# Altium project FMC_DAC_125M_14B_16CHA.PrjPCB (part 1 of 2)
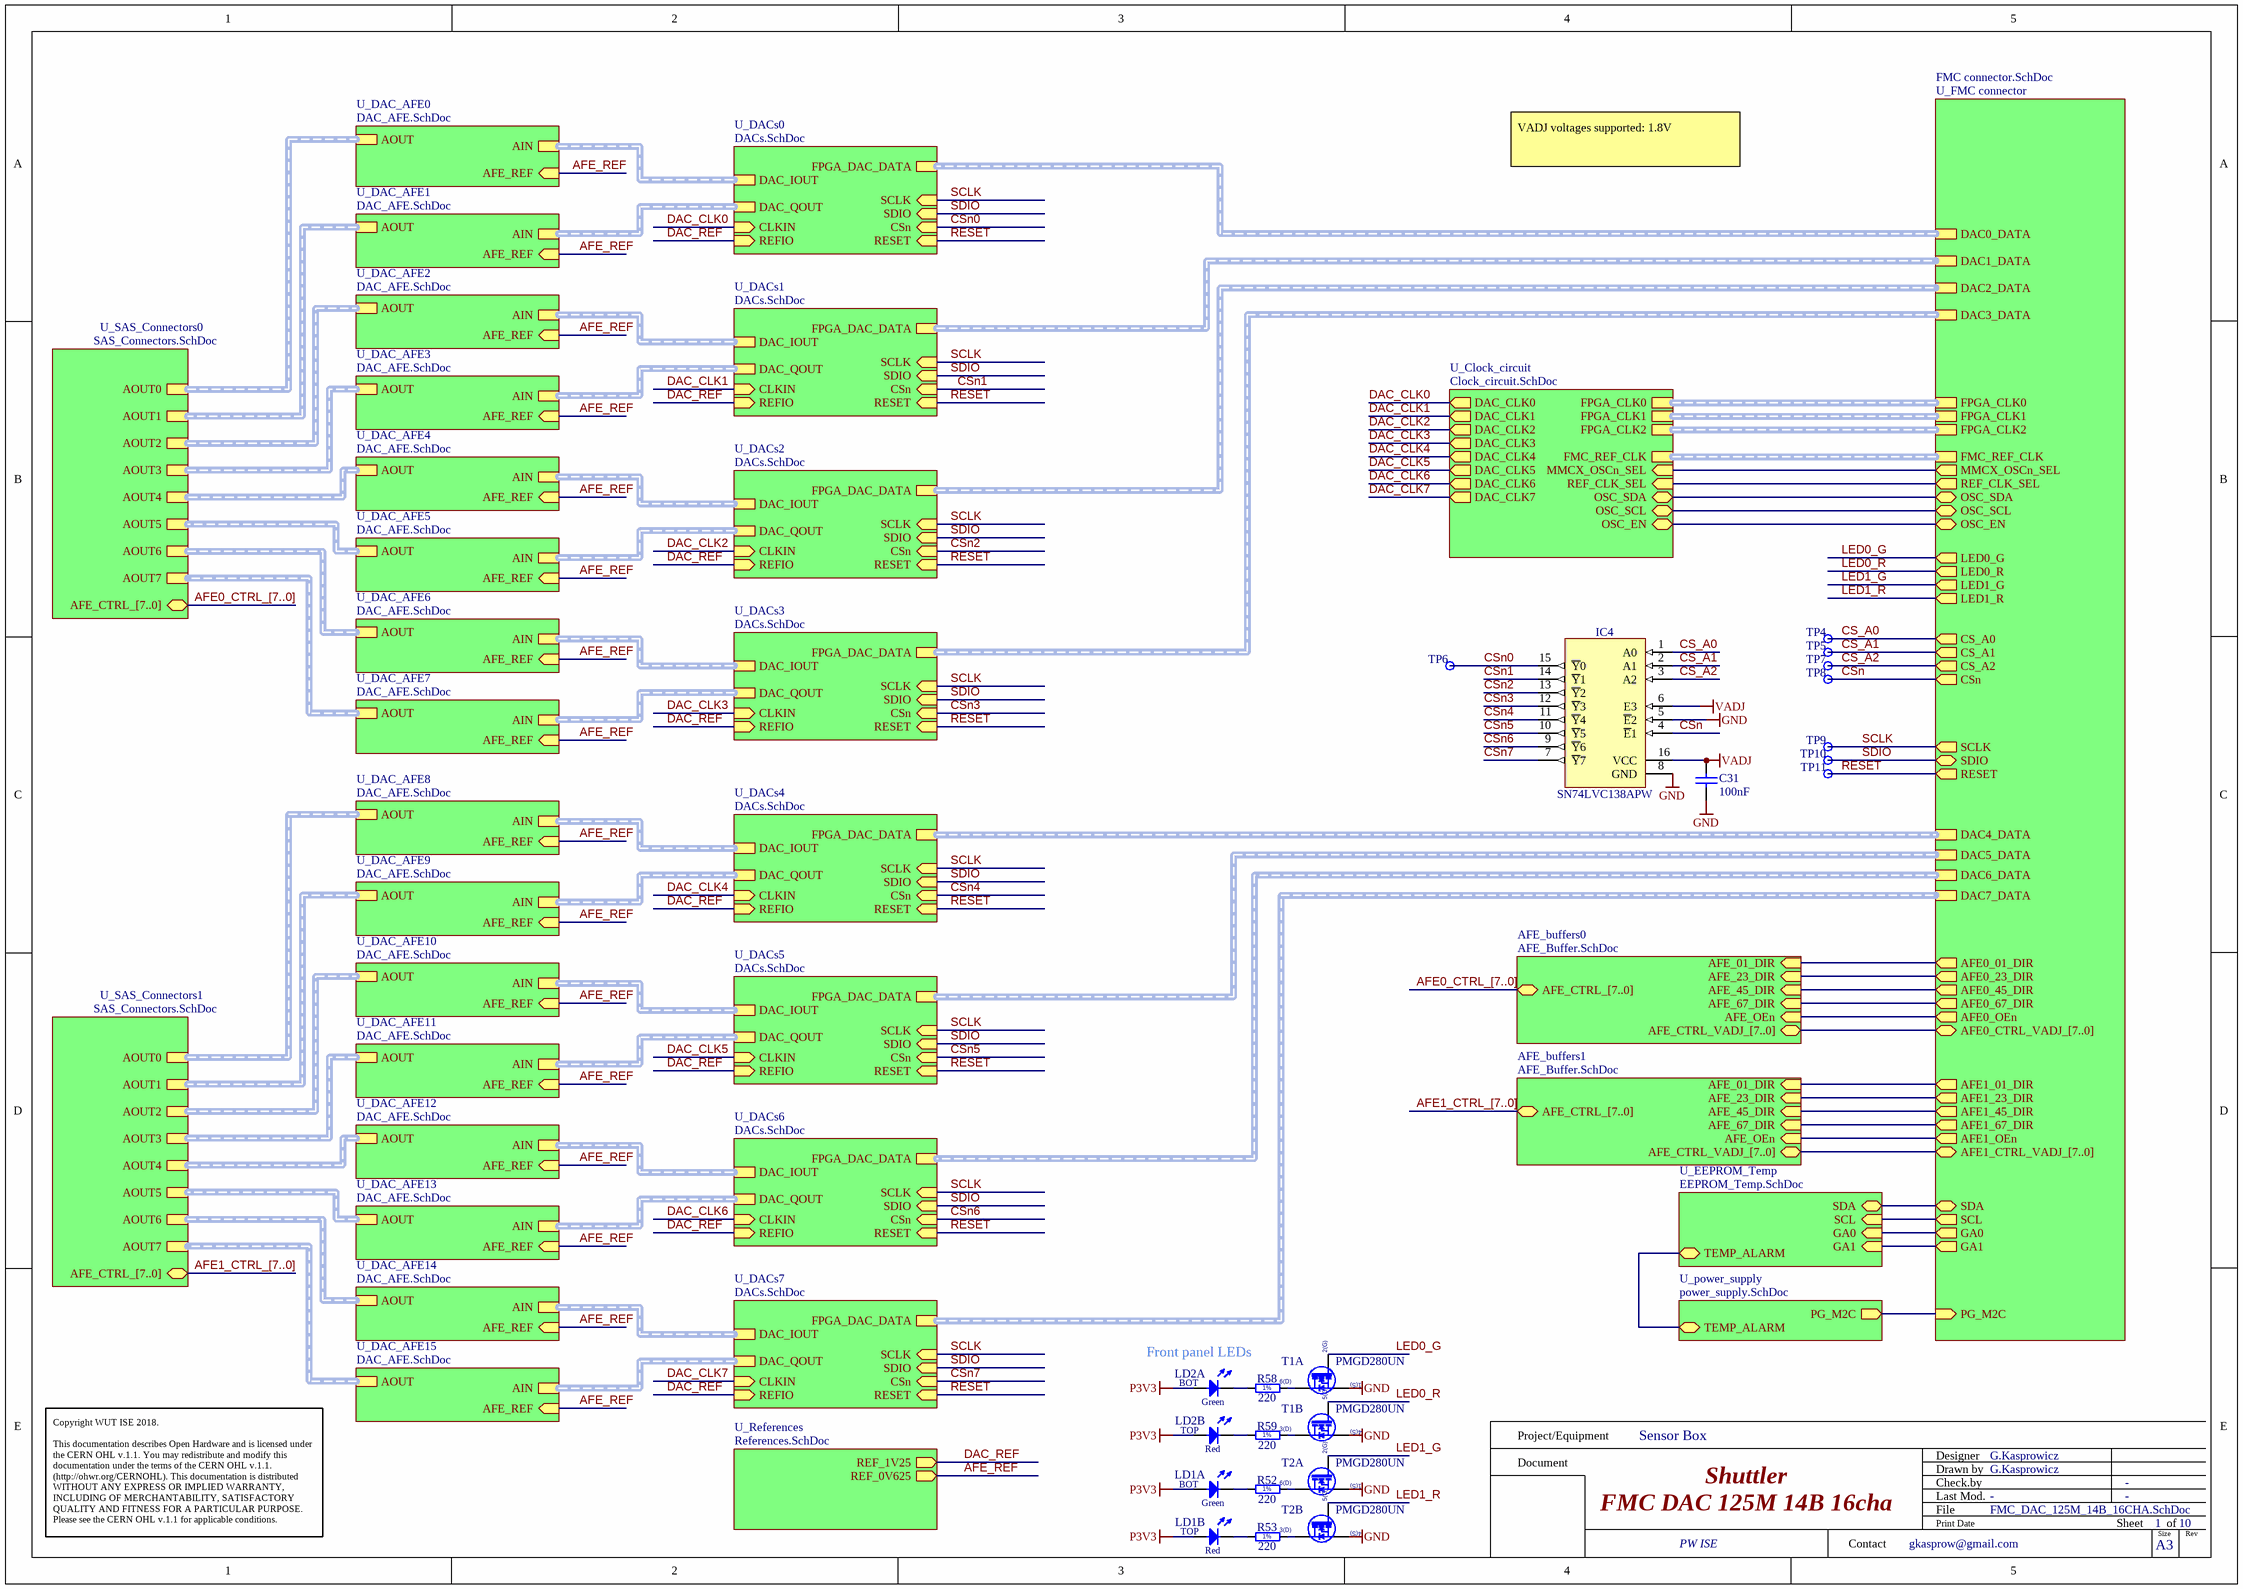
[diagram p0: FMC_DAC_125M_14B_16CHA.SchDoc]
P_version: 1.2
5 sheets, 161 parts. Net scope: hierarchical (ports join the sheet entries above them; power ports are global).
Board file: FMC_DAC_125M_14B_16CHA.PcbDoc
Sheets:
  FMC_DAC_125M_14B_16CHA.SchDoc
    U_EEPROM_Temp = EEPROM_Temp.SchDoc
    U_DACs0 = DACs.SchDoc
    U_DACs1 = DACs.SchDoc
    U_DACs2 = DACs.SchDoc
    U_DACs3 = DACs.SchDoc
    U_DACs4 = DACs.SchDoc
    U_DACs5 = DACs.SchDoc
    U_DACs6 = DACs.SchDoc
    U_DACs7 = DACs.SchDoc
    U_Clock_circuit = Clock_circuit.SchDoc
    U_References = References.SchDoc

## Sheet FMC_DAC_125M_14B_16CHA.SchDoc: Shuttler
size 420 x 297 mm; Author: G.Kasprowicz; CompanyName: WUT ISE; DrawnBy: G.Kasprowicz; Organization: WUT ISE; Address1: PW ISE; Address2: Nowowiejska 15/19 00-665 Warsaw; Address3: gkasprow@gmail.com; DocumentNumber: 1; Revision: 1.2; SheetNumber: 1; SheetTotal: 10; ModifiedBy: -; CheckedDate: -; Title2: FMC DAC 125M 14B 16cha; DivGrp: WUT ISE; Designer: G.Kasprowicz; ModifiedDate: -; ProjectName: Sensor Box

### Parts
C31  100nF  [CAPC1005X55N]
IC4  SN74LVC138APW  [SOP65P640X110-16N]
LD1  Red/Green  [LED_DIALIGHT_571-0112F]  (value not drawn)  (parts A,B of 2)
LD2  Red/Green  [LED_DIALIGHT_571-0112F]  (value not drawn)  (parts A,B of 2)
R52  220  [RESC1608X55N]
R53  220  [RESC1608X55N]
R58  220  [RESC1608X55N]
R59  220  [RESC1608X55N]
T1  PMGD280UN  [SOT65P210X110-6N]  (parts A,B of 2)
T2  PMGD280UN  [SOT65P210X110-6N]  (parts A,B of 2)
TP4  Test Point  [TPS127]  (value not drawn)  (no BOM)
TP5  Test Point  [TPS127]  (value not drawn)  (no BOM)
TP6  Test Point  [TPS127]  (value not drawn)  (no BOM)
TP7  Test Point  [TPS127]  (value not drawn)  (no BOM)
TP8  Test Point  [TPS127]  (value not drawn)  (no BOM)
TP9  Test Point  [TPS127]  (value not drawn)  (no BOM)
TP10  Test Point  [TPS127]  (value not drawn)  (no BOM)
TP11  Test Point  [TPS127]  (value not drawn)  (no BOM)

### Sub-sheets
AFE_buffers0 = AFE_Buffer.SchDoc (file not in this document): AFE_CTRL_[7..0] (bidir), AFE_23_DIR (in), AFE_67_DIR (in), AFE_01_DIR (in), AFE_OEn (in), AFE_45_DIR (in), AFE_CTRL_VADJ_[7..0] (bidir)
AFE_buffers1 = AFE_Buffer.SchDoc (file not in this document): AFE_CTRL_[7..0] (bidir), AFE_23_DIR (in), AFE_67_DIR (in), AFE_01_DIR (in), AFE_OEn (in), AFE_45_DIR (in), AFE_CTRL_VADJ_[7..0] (bidir)
U_Clock_circuit = Clock_circuit.SchDoc: FPGA_CLK0 (harness DIFFCLK), FPGA_CLK1 (harness DIFFCLK), FPGA_CLK2 (harness DIFFCLK), DAC_CLK0 (out), DAC_CLK1 (out), DAC_CLK2 (out), DAC_CLK3 (out), DAC_CLK4 (out), DAC_CLK5 (out), DAC_CLK6 (out), DAC_CLK7 (out), OSC_SDA (bidir), OSC_SCL (bidir), OSC_EN (bidir), MMCX_OSCn_SEL (in), FMC_REF_CLK (harness DIFFCLK), REF_CLK_SEL (in)
U_DAC_AFE0 = DAC_AFE.SchDoc (file not in this document): AIN (harness DIFF), AOUT (harness DIFF), AFE_REF (in)
U_DAC_AFE1 = DAC_AFE.SchDoc (file not in this document): AIN (harness DIFF), AOUT (harness DIFF), AFE_REF (in)
U_DAC_AFE2 = DAC_AFE.SchDoc (file not in this document): AIN (harness DIFF), AOUT (harness DIFF), AFE_REF (in)
U_DAC_AFE3 = DAC_AFE.SchDoc (file not in this document): AIN (harness DIFF), AOUT (harness DIFF), AFE_REF (in)
U_DAC_AFE4 = DAC_AFE.SchDoc (file not in this document): AIN (harness DIFF), AOUT (harness DIFF), AFE_REF (in)
U_DAC_AFE5 = DAC_AFE.SchDoc (file not in this document): AIN (harness DIFF), AOUT (harness DIFF), AFE_REF (in)
U_DAC_AFE6 = DAC_AFE.SchDoc (file not in this document): AIN (harness DIFF), AOUT (harness DIFF), AFE_REF (in)
U_DAC_AFE7 = DAC_AFE.SchDoc (file not in this document): AIN (harness DIFF), AOUT (harness DIFF), AFE_REF (in)
U_DAC_AFE8 = DAC_AFE.SchDoc (file not in this document): AIN (harness DIFF), AOUT (harness DIFF), AFE_REF (in)
U_DAC_AFE9 = DAC_AFE.SchDoc (file not in this document): AIN (harness DIFF), AOUT (harness DIFF), AFE_REF (in)
U_DAC_AFE10 = DAC_AFE.SchDoc (file not in this document): AIN (harness DIFF), AOUT (harness DIFF), AFE_REF (in)
U_DAC_AFE11 = DAC_AFE.SchDoc (file not in this document): AIN (harness DIFF), AOUT (harness DIFF), AFE_REF (in)
U_DAC_AFE12 = DAC_AFE.SchDoc (file not in this document): AIN (harness DIFF), AOUT (harness DIFF), AFE_REF (in)
U_DAC_AFE13 = DAC_AFE.SchDoc (file not in this document): AIN (harness DIFF), AOUT (harness DIFF), AFE_REF (in)
U_DAC_AFE14 = DAC_AFE.SchDoc (file not in this document): AIN (harness DIFF), AOUT (harness DIFF), AFE_REF (in)
U_DAC_AFE15 = DAC_AFE.SchDoc (file not in this document): AIN (harness DIFF), AOUT (harness DIFF), AFE_REF (in)
U_DACs0 = DACs.SchDoc: FPGA_DAC_DATA (harness DAC_DATA_E), SCLK (in), SDIO (in), CSn (in), RESET (in), DAC_IOUT (harness DIFF), DAC_QOUT (harness DIFF), CLKIN (in), REFIO (in)
U_DACs1 = DACs.SchDoc: FPGA_DAC_DATA (harness DAC_DATA_E), SCLK (in), SDIO (in), CSn (in), RESET (in), DAC_IOUT (harness DIFF), DAC_QOUT (harness DIFF), CLKIN (in), REFIO (in)
U_DACs2 = DACs.SchDoc: FPGA_DAC_DATA (harness DAC_DATA_E), SCLK (in), SDIO (in), CSn (in), RESET (in), DAC_IOUT (harness DIFF), DAC_QOUT (harness DIFF), CLKIN (in), REFIO (in)
U_DACs3 = DACs.SchDoc: FPGA_DAC_DATA (harness DAC_DATA_E), SCLK (in), SDIO (in), CSn (in), RESET (in), DAC_IOUT (harness DIFF), DAC_QOUT (harness DIFF), CLKIN (in), REFIO (in)
U_DACs4 = DACs.SchDoc: FPGA_DAC_DATA (harness DAC_DATA_E), SCLK (in), SDIO (in), CSn (in), RESET (in), DAC_IOUT (harness DIFF), DAC_QOUT (harness DIFF), CLKIN (in), REFIO (in)
U_DACs5 = DACs.SchDoc: FPGA_DAC_DATA (harness DAC_DATA_E), SCLK (in), SDIO (in), CSn (in), RESET (in), DAC_IOUT (harness DIFF), DAC_QOUT (harness DIFF), CLKIN (in), REFIO (in)
U_DACs6 = DACs.SchDoc: FPGA_DAC_DATA (harness DAC_DATA_E), SCLK (in), SDIO (in), CSn (in), RESET (in), DAC_IOUT (harness DIFF), DAC_QOUT (harness DIFF), CLKIN (in), REFIO (in)
U_DACs7 = DACs.SchDoc: FPGA_DAC_DATA (harness DAC_DATA_E), SCLK (in), SDIO (in), CSn (in), RESET (in), DAC_IOUT (harness DIFF), DAC_QOUT (harness DIFF), CLKIN (in), REFIO (in)
U_EEPROM_Temp = EEPROM_Temp.SchDoc: SDA (bidir), SCL (in), GA0 (in), GA1 (in), TEMP_ALARM (bidir)
U_FMC connector = FMC connector.SchDoc (file not in this document): SDA (bidir), GA1 (out), GA0 (out), SCL (out), CS_A2 (out), CSn (out), CS_A0 (out), CS_A1 (out), SCLK (out), SDIO (bidir), RESET (out), DAC4_DATA (harness DAC_DATA_E), DAC5_DATA (harness DAC_DATA_E), DAC6_DATA (harness DAC_DATA_E), DAC7_DATA (harness DAC_DATA_E), DAC1_DATA (harness DAC_DATA_E), DAC2_DATA (harness DAC_DATA_E), DAC3_DATA (harness DAC_DATA_E), DAC0_DATA (harness DAC_DATA_E), FPGA_CLK0 (harness DIFF), FPGA_CLK1 (harness DIFF), FPGA_CLK2 (harness DIFF), FMC_REF_CLK (harness DIFF), MMCX_OSCn_SEL (out), REF_CLK_SEL (out), OSC_SDA (bidir), OSC_SCL (bidir), OSC_EN (bidir), AFE0_01_DIR (out), AFE0_23_DIR (out), AFE0_45_DIR (out), AFE0_67_DIR (out), AFE0_OEn (out), AFE0_CTRL_VADJ_[7..0] (bidir), AFE1_CTRL_VADJ_[7..0] (bidir), AFE1_01_DIR (out), AFE1_23_DIR (out), AFE1_45_DIR (out), AFE1_67_DIR (out), AFE1_OEn (out), PG_M2C (in), LED0_G (out), LED0_R (out), LED1_G (out), LED1_R (out)
U_power_supply = power_supply.SchDoc (file not in this document): PG_M2C (out), TEMP_ALARM (bidir)
U_References = References.SchDoc: REF_1V25 (out), REF_0V625 (out)
U_SAS_Connectors0 = SAS_Connectors.SchDoc (file not in this document): AOUT4 (harness DIFF), AOUT0 (harness DIFF), AOUT1 (harness DIFF), AOUT2 (harness DIFF), AOUT6 (harness DIFF), AOUT7 (harness DIFF), AFE_CTRL_[7..0] (bidir), AOUT3 (harness DIFF), AOUT5 (harness DIFF)
U_SAS_Connectors1 = SAS_Connectors.SchDoc (file not in this document): AOUT4 (harness DIFF), AOUT0 (harness DIFF), AOUT1 (harness DIFF), AOUT2 (harness DIFF), AOUT6 (harness DIFF), AOUT7 (harness DIFF), AOUT3 (harness DIFF), AOUT5 (harness DIFF), AFE_CTRL_[7..0] (bidir)

### Nets
GND: C31.1 IC4.5(~{E}2) IC4.8(GND) T1.1(S) T1.4(S) T2.1(S) T2.4(S)
P3V3: LD1.2(A) LD1.4(A) LD2.2(A) LD2.4(A)
VADJ: C31.2 IC4.6(E3) IC4.16(VCC)
AFE_REF: sheet U_DAC_AFE0/AFE_REF, sheet U_DAC_AFE1/AFE_REF, sheet U_DAC_AFE2/AFE_REF, sheet U_DAC_AFE3/AFE_REF, sheet U_DAC_AFE4/AFE_REF, sheet U_DAC_AFE5/AFE_REF, sheet U_DAC_AFE6/AFE_REF, sheet U_DAC_AFE7/AFE_REF, sheet U_DAC_AFE8/AFE_REF, sheet U_DAC_AFE9/AFE_REF, sheet U_DAC_AFE10/AFE_REF, sheet U_DAC_AFE11/AFE_REF, sheet U_DAC_AFE12/AFE_REF, sheet U_DAC_AFE13/AFE_REF, sheet U_DAC_AFE14/AFE_REF, sheet U_DAC_AFE15/AFE_REF, sheet U_References/REF_0V625
CS_A0: IC4.1(A0) TP4.1 ; sheet U_FMC connector/CS_A0
CS_A1: IC4.2(A1) TP5.1 ; sheet U_FMC connector/CS_A1
CS_A2: IC4.3(A2) TP7.1 ; sheet U_FMC connector/CS_A2
CSn: IC4.4(~{E}1) TP8.1 ; sheet U_FMC connector/CSn
CSn0: IC4.15(~{Y}0) TP6.1 ; sheet U_DACs0/CSn
CSn1: IC4.14(~{Y}1) ; sheet U_DACs1/CSn
CSn2: IC4.13(~{Y}2) ; sheet U_DACs2/CSn
CSn3: IC4.12(~{Y}3) ; sheet U_DACs3/CSn
CSn4: IC4.11(~{Y}4) ; sheet U_DACs4/CSn
CSn5: IC4.10(~{Y}5) ; sheet U_DACs5/CSn
CSn6: IC4.9(~{Y}6) ; sheet U_DACs6/CSn
CSn7: IC4.7(~{Y}7) ; sheet U_DACs7/CSn
DAC_CLK0: sheet U_DACs0/CLKIN, sheet U_Clock_circuit/DAC_CLK0
DAC_CLK1: sheet U_DACs1/CLKIN, sheet U_Clock_circuit/DAC_CLK1
DAC_CLK2: sheet U_DACs2/CLKIN, sheet U_Clock_circuit/DAC_CLK2
DAC_CLK3: sheet U_DACs3/CLKIN, sheet U_Clock_circuit/DAC_CLK3
DAC_CLK4: sheet U_DACs4/CLKIN, sheet U_Clock_circuit/DAC_CLK4
DAC_CLK5: sheet U_DACs5/CLKIN, sheet U_Clock_circuit/DAC_CLK5
DAC_CLK6: sheet U_DACs6/CLKIN, sheet U_Clock_circuit/DAC_CLK6
DAC_CLK7: sheet U_DACs7/CLKIN, sheet U_Clock_circuit/DAC_CLK7
DAC_REF: sheet U_DACs0/REFIO, sheet U_DACs1/REFIO, sheet U_DACs2/REFIO, sheet U_DACs3/REFIO, sheet U_DACs4/REFIO, sheet U_DACs5/REFIO, sheet U_DACs6/REFIO, sheet U_DACs7/REFIO, sheet U_References/REF_1V25
LED0_G: T1.2(G) ; sheet U_FMC connector/LED0_G
LED0_R: T1.5(G) ; sheet U_FMC connector/LED0_R
LED1_G: T2.2(G) ; sheet U_FMC connector/LED1_G
LED1_R: T2.5(G) ; sheet U_FMC connector/LED1_R
MMCX_OSCn_SEL: sheet U_FMC connector/MMCX_OSCn_SEL, sheet U_Clock_circuit/MMCX_OSCn_SEL
REF_SEL: sheet U_FMC connector/REF_CLK_SEL, sheet U_Clock_circuit/REF_CLK_SEL
RESET: TP11.1 ; sheet U_FMC connector/RESET, sheet U_DACs0/RESET, sheet U_DACs1/RESET, sheet U_DACs2/RESET, sheet U_DACs3/RESET, sheet U_DACs4/RESET, sheet U_DACs5/RESET, sheet U_DACs6/RESET, sheet U_DACs7/RESET
SCL: sheet U_EEPROM_Temp/SCL, sheet U_FMC connector/SCL
SCLK: TP9.1 ; sheet U_FMC connector/SCLK, sheet U_DACs0/SCLK, sheet U_DACs1/SCLK, sheet U_DACs2/SCLK, sheet U_DACs3/SCLK, sheet U_DACs4/SCLK, sheet U_DACs5/SCLK, sheet U_DACs6/SCLK, sheet U_DACs7/SCLK
SDA: sheet U_EEPROM_Temp/SDA, sheet U_FMC connector/SDA
SDIO: TP10.1 ; sheet U_FMC connector/SDIO, sheet U_DACs0/SDIO, sheet U_DACs1/SDIO, sheet U_DACs2/SDIO, sheet U_DACs3/SDIO, sheet U_DACs4/SDIO, sheet U_DACs5/SDIO, sheet U_DACs6/SDIO, sheet U_DACs7/SDIO
TEMP_ALARM: sheet U_EEPROM_Temp/TEMP_ALARM, sheet U_power_supply/TEMP_ALARM
NetIC40_1: sheet U_EEPROM_Temp/GA1, sheet U_FMC connector/GA1
NetIC40_2: sheet U_EEPROM_Temp/GA0, sheet U_FMC connector/GA0
NetLD1_1: LD1.1(C) R52.1
NetLD1_3: LD1.3(C) R53.1
NetLD2_1: LD2.1(C) R58.1
NetLD2_3: LD2.3(C) R59.1
NetOSC1_7: sheet U_FMC connector/OSC_SDA, sheet U_Clock_circuit/OSC_SDA
NetOSC1_8: sheet U_FMC connector/OSC_SCL, sheet U_Clock_circuit/OSC_SCL
NetR8_1: sheet U_FMC connector/OSC_EN, sheet U_Clock_circuit/OSC_EN
NetR52_2: R52.2 T2.6(D)
NetR53_2: R53.2 T2.3(D)
NetR58_2: R58.2 T1.6(D)
NetR59_2: R59.2 T1.3(D)
(unnamed): sheet U_FMC connector/AFE0_01_DIR, sheet AFE_buffers0/AFE_01_DIR
(unnamed): sheet U_FMC connector/AFE0_23_DIR, sheet AFE_buffers0/AFE_23_DIR
(unnamed): sheet U_FMC connector/AFE0_45_DIR, sheet AFE_buffers0/AFE_45_DIR
(unnamed): sheet U_FMC connector/AFE0_67_DIR, sheet AFE_buffers0/AFE_67_DIR
(unnamed): sheet U_FMC connector/AFE0_OEn, sheet AFE_buffers0/AFE_OEn
(unnamed): sheet U_FMC connector/AFE1_01_DIR, sheet AFE_buffers1/AFE_01_DIR
(unnamed): sheet U_FMC connector/AFE1_23_DIR, sheet AFE_buffers1/AFE_23_DIR
(unnamed): sheet U_FMC connector/AFE1_45_DIR, sheet AFE_buffers1/AFE_45_DIR
(unnamed): sheet U_FMC connector/AFE1_67_DIR, sheet AFE_buffers1/AFE_67_DIR
(unnamed): sheet U_FMC connector/AFE1_OEn, sheet AFE_buffers1/AFE_OEn
(unnamed): sheet U_FMC connector/PG_M2C, sheet U_power_supply/PG_M2C

### Buses and harness runs
bus AFE0_CTRL_[7..0] = sheet AFE_buffers0/AFE_CTRL_[7..0]
bus AFE0_CTRL_[7..0] = sheet U_SAS_Connectors0/AFE_CTRL_[7..0]
bus AFE1_CTRL_[7..0] = sheet AFE_buffers1/AFE_CTRL_[7..0]
bus AFE1_CTRL_[7..0] = sheet U_SAS_Connectors1/AFE_CTRL_[7..0]
bus sheet AFE_buffers0/AFE_CTRL_VADJ_[7..0] = sheet U_FMC connector/AFE0_CTRL_VADJ_[7..0]
bus sheet AFE_buffers1/AFE_CTRL_VADJ_[7..0] = sheet U_FMC connector/AFE1_CTRL_VADJ_[7..0]
harness sheet U_Clock_circuit/FMC_REF_CLK = sheet U_FMC connector/FMC_REF_CLK
harness sheet U_Clock_circuit/FPGA_CLK0 = sheet U_FMC connector/FPGA_CLK0
harness sheet U_Clock_circuit/FPGA_CLK1 = sheet U_FMC connector/FPGA_CLK1
harness sheet U_Clock_circuit/FPGA_CLK2 = sheet U_FMC connector/FPGA_CLK2
harness sheet U_DAC_AFE0/AIN = sheet U_DACs0/DAC_IOUT
harness sheet U_DAC_AFE0/AOUT = sheet U_SAS_Connectors0/AOUT0
harness sheet U_DAC_AFE1/AIN = sheet U_DACs0/DAC_QOUT
harness sheet U_DAC_AFE1/AOUT = sheet U_SAS_Connectors0/AOUT1
harness sheet U_DAC_AFE2/AIN = sheet U_DACs1/DAC_IOUT
harness sheet U_DAC_AFE2/AOUT = sheet U_SAS_Connectors0/AOUT2
harness sheet U_DAC_AFE3/AIN = sheet U_DACs1/DAC_QOUT
harness sheet U_DAC_AFE3/AOUT = sheet U_SAS_Connectors0/AOUT3
harness sheet U_DAC_AFE4/AIN = sheet U_DACs2/DAC_IOUT
harness sheet U_DAC_AFE4/AOUT = sheet U_SAS_Connectors0/AOUT4
harness sheet U_DAC_AFE5/AIN = sheet U_DACs2/DAC_QOUT
harness sheet U_DAC_AFE5/AOUT = sheet U_SAS_Connectors0/AOUT5
harness sheet U_DAC_AFE6/AIN = sheet U_DACs3/DAC_IOUT
harness sheet U_DAC_AFE6/AOUT = sheet U_SAS_Connectors0/AOUT6
harness sheet U_DAC_AFE7/AIN = sheet U_DACs3/DAC_QOUT
harness sheet U_DAC_AFE7/AOUT = sheet U_SAS_Connectors0/AOUT7
harness sheet U_DAC_AFE8/AIN = sheet U_DACs4/DAC_IOUT
harness sheet U_DAC_AFE8/AOUT = sheet U_SAS_Connectors1/AOUT0
harness sheet U_DAC_AFE9/AIN = sheet U_DACs4/DAC_QOUT
harness sheet U_DAC_AFE9/AOUT = sheet U_SAS_Connectors1/AOUT1
harness sheet U_DAC_AFE10/AIN = sheet U_DACs5/DAC_IOUT
harness sheet U_DAC_AFE10/AOUT = sheet U_SAS_Connectors1/AOUT2
harness sheet U_DAC_AFE11/AIN = sheet U_DACs5/DAC_QOUT
harness sheet U_DAC_AFE11/AOUT = sheet U_SAS_Connectors1/AOUT3
harness sheet U_DAC_AFE12/AIN = sheet U_DACs6/DAC_IOUT
harness sheet U_DAC_AFE12/AOUT = sheet U_SAS_Connectors1/AOUT4
harness sheet U_DAC_AFE13/AIN = sheet U_DACs6/DAC_QOUT
harness sheet U_DAC_AFE13/AOUT = sheet U_SAS_Connectors1/AOUT5
harness sheet U_DAC_AFE14/AIN = sheet U_DACs7/DAC_IOUT
harness sheet U_DAC_AFE14/AOUT = sheet U_SAS_Connectors1/AOUT6
harness sheet U_DAC_AFE15/AIN = sheet U_DACs7/DAC_QOUT
harness sheet U_DAC_AFE15/AOUT = sheet U_SAS_Connectors1/AOUT7
harness sheet U_DACs0/FPGA_DAC_DATA = sheet U_FMC connector/DAC0_DATA
harness sheet U_DACs1/FPGA_DAC_DATA = sheet U_FMC connector/DAC1_DATA
harness sheet U_DACs2/FPGA_DAC_DATA = sheet U_FMC connector/DAC2_DATA
harness sheet U_DACs3/FPGA_DAC_DATA = sheet U_FMC connector/DAC3_DATA
harness sheet U_DACs4/FPGA_DAC_DATA = sheet U_FMC connector/DAC4_DATA
harness sheet U_DACs5/FPGA_DAC_DATA = sheet U_FMC connector/DAC5_DATA
harness sheet U_DACs6/FPGA_DAC_DATA = sheet U_FMC connector/DAC6_DATA
harness sheet U_DACs7/FPGA_DAC_DATA = sheet U_FMC connector/DAC7_DATA

### Notes on the sheet
- VADJ voltages supported: 1.8V
- Front panel LEDs
- Project/Equipment
- Document
- Designer
- Drawn by
- Check.by
- Copyright WUT ISE 2018.
  This documentation describes Open Hardware and is licensed under the CERN OHL v.1.1. You may redistribute and modify this documentation under the terms of the CERN OHL v.1.1. (http://ohwr.org/CERNOHL). This documentation is distributed WITHOUT ANY EXPRESS OR IMPLIED WARRANTY, INCLUDING OF MERCHANTABILITY, SATISFACTORY QUALITY AND FITNESS FOR A PARTICULAR PURPOSE. Please see the CERN OHL v.1.1 for applicable conditions.
- Contact
- File
- Last Mod.
- Print Date
- Sheet
- Size
- A3
- of
- Rev
- (in symbol LED_DIALIGHT_571-0112F, part A) BOT; Green
- (in symbol LED_DIALIGHT_571-0112F, part B) TOP; Red
- (in symbol PMGD280UN, part A) 2(G); 1(S); 6(D)
- (in symbol PMGD280UN, part B) 5(G); 4(S); 3(D)
- (in symbol R0603_220R_1%_0.1W_100PPM) 1%

### Library data of the parts
C31 = CC0402_100NF_16V_10%_X5R: Non-polarised capacitor; Part Description: SMD Multilayer Chip Ceramic Capacitor; Manufacturer: GENERIC; Manufacturer1 Part Number: GRM155R61C104KA88D; Voltage: 16V; TC: X5R; Tolerance: ±10%; Part Number: CC0402_100NF_16V_10%_X5R; Component Kind: Standard; Component Type: Standard; Pin Count: 2; Value: 100nF; Status: None; Manufacturer Part Number: CC0402_100NF_16V_10%_X5R; Case: 0402; Mounted: Yes; Socket: No; SMD: Yes; Sense: No; Manufacturer1 Example: MURATA; Manufacturer1 ComponentHeight: 0.55mm; HelpURL: \\cern.ch\dfs\Applications\Altium\Datasheets\CC0402_X5R_MURATA_GRM.pdf; Author: CERN DEM JLC; CreateDate: 10.12.2013; LatestRevisionDate: 10.12.2013
IC4 = SN74LVC138APW: 3-Line to 8-Line Decoder/Demultiplexer; Part Description: 3-Line to 8-Line Decoder/Demultiplexer, Inverting; Manufacturer: Texas Instruments; PressFit: No; Bonding: No; Part Number: SN74LVC138APW; Component Kind: Standard; Component Type: Standard; Device: SN74LVC138APW; PackageDescription: SOP, 0.65mm pitch; 16 pin, 4.40mm W X 5.00mm L X 1.10mm H body IPC Medium Density; Manufacturer Part Number: SN74LVC138APW; Pin Count: 16; Case: TSSOP16; Mounted: Yes; Socket: No; SMD: Yes; Sense: No; ComponentHeight: 1.1mm; Author: GK; HelpURL: \\cern.ch\dfs\Applications\Altium\Datasheets\74HC138PW.pdf; CreateDate: 09/06/2015; LatestRevisionDate: 09/06/2015
LD1 LD2 = LED_DIALIGHT_571-0112F: 2x LED  Botom Green, Top Red; Part Description: Dual 2mm  LEDs, Red Top,Green Bot, CBI® Circuit Board Indicator (Without positioning pins); PressFit: No; Bonding: No; Part Number: LED_DIALIGHT_571-0112F; Component Kind: Standard; Component Type: Standard; Color: Red/Green; PackageDescription: 2x 2mm LED (Top: Red, Bot: Green) PCB Edge Mounting (Without positioning pins) DIALIGHT 571 Serie; Manufacturer: DIALIGHT; Manufacturer Part Number: 571-0112F; Pin Count: 4; Mounted: Yes; Socket: No; SMD: No; Sense: No; ComponentHeight: 8.6mm; HelpURL: \\cern.ch\dfs\Applications\Altium\Datasheets\LED_DIALIGHT_571-0112F.pdf; Author: CERN DEM JLC; CreateDate: 09/11/2009; LatestRevisionDate: 17/03/2010
R52 R53 R58 R59 = R0603_220R_1%_0.1W_100PPM: Resistor - 1%; Part Description: General Purpose Thick Film Chip Resistor; Manufacturer: GENERIC; Manufacturer1 Part Number: NRC06F2200TRF; Power: 0.1W; TC: ±100ppm/°C; Part Number: R0603_220R_1%_0.1W_100PPM; Component Kind: Standard; Component Type: Standard; Pin Count: 2; Value: 220; Status: Preferred; Tolerance: ±1%; Manufacturer Part Number: R0603_220R_1%_0.1W_100PPM; Case: 0603; Mounted: Yes; Sense: No; Socket: No; SMD: Yes; Manufacturer1 Example: NIC COMPONENT; Manufacturer1 ComponentHeight: 0.55mm; HelpURL: \\cern.ch\dfs\Applications\Altium\Datasheets\R0603_NIC_NRC.pdf; Author: CERN DEM JLC; CreateDate: 03.12.2007; LatestRevisionDate: 13.03.2008
T1 T2 = PMGD280UN: Dual N-Channel micro TrenchMOS™ Ultra Low Level FET; Part Description: 20V 870mA Dual N-Channel micro TrenchMOS™ Ultra Low Level FET; Manufacturer: NXP SEMICONDUCTORS; PressFit: No; Bonding: No; Part Number: PMGD280UN; Component Kind: Standard; Component Type: Standard; Device: PMGD280UN; PackageDescription: SOT363, SC70-6, SOT, 0.65mm Pitch, 6 pin, 1.25mm W X 2.00mm L X 1.10mm H, IPC Medium Density; Manufacturer Part Number: PMGD280UN; Pin Count: 6; Case: SOT363; Mounted: Yes; Socket: No; SMD: Yes; Sense: No; ComponentHeight: 1.1mm; HelpURL: \\cern.ch\dfs\Applications\Altium\Datasheets\PMGD280UN.pdf; Author: CERN DEM JLC; CreateDate: 19/11/2014; LatestRevisionDate: 19/11/2014
TP4-TP11 = SMD_PAD_1.27X1.27MM: Part Description: 1.27mm x 1.27mm PCB Copper Area (SMD Test Point); Mounted: No; Part Number: SMD_PAD_1.27X1.27MM; Component Type: Standard (No BOM); Pin Count: 1; Family: Test Point; Socket: No; SMD: Yes; Sense: No; Status: None; ComponentHeight: 0mm; HelpURL: Undefined; Author: CERN DEM JLC; CreateDate: 12.01.2008; LatestRevisionDate: 12.01.2008; PackageDescription: 1.27mm x 1.27mm PCB Copper Area (SMD Test Point)

## Sheet EEPROM_Temp.SchDoc: Shuttler
size 420 x 297 mm; Author: G.Kasprowicz; CompanyName: WUT ISE; DrawnBy: G.Kasprowicz; Organization: WUT ISE; Address1: PW ISE; Address2: Nowowiejska 15/19 00-665 Warsaw; Address3: gkasprow@gmail.com; DocumentNumber: 6; Revision: 1.2; SheetNumber: 6; SheetTotal: 10; ModifiedBy: -; CheckedDate: -; Title2: EEPROM, temperature sensor; DivGrp: WUT ISE; Designer: G.Kasprowicz; ModifiedDate: -; ProjectName: Sensor Box
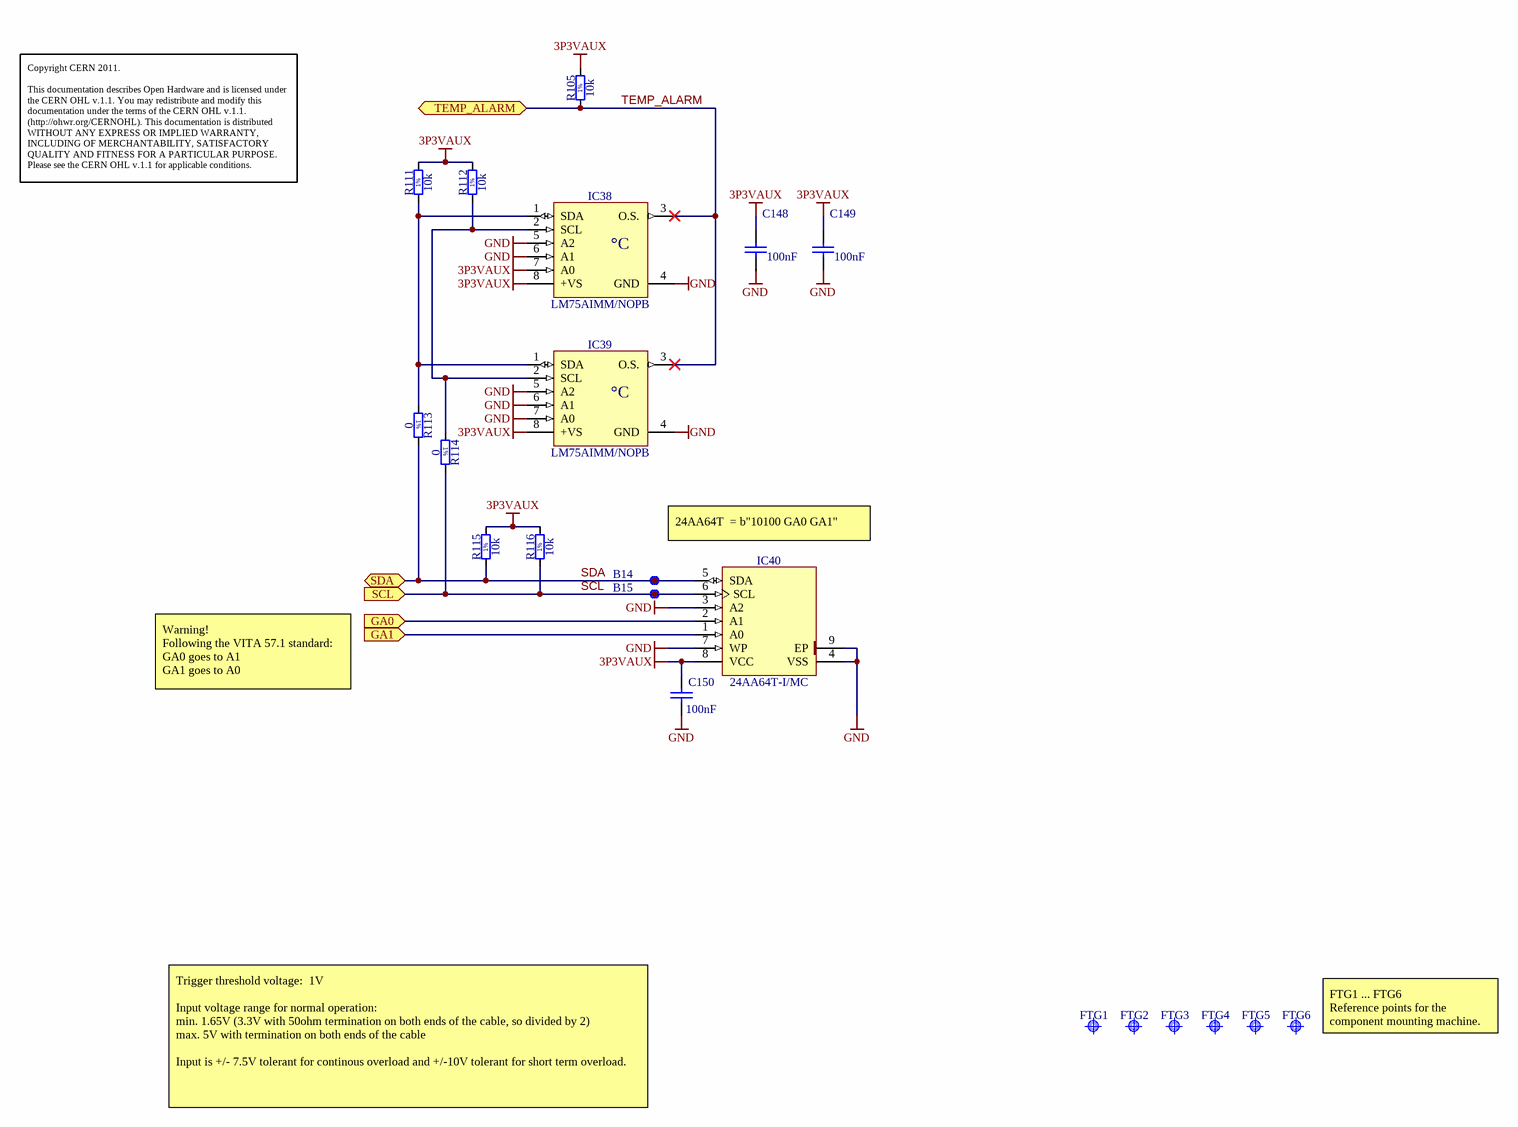
[diagram p1: EEPROM_Temp.SchDoc]

### Parts
B14  SMD Pad  [C100]  (value not drawn)
B15  SMD Pad  [C100]  (value not drawn)
C148  100nF  [CAPC0603X33N]
C149  100nF  [CAPC0603X33N]
C150  100nF  [CAPC0603X33N]
FTG1  Use only in PCB  [FIDUCIAL_TOP_S100-200]  (value not drawn)
FTG2  Use only in PCB  [FIDUCIAL_TOP_S100-200]  (value not drawn)
FTG3  Use only in PCB  [FIDUCIAL_TOP_S100-200]  (value not drawn)
FTG4  Use only in PCB  [FIDUCIAL_TOP_S100-200]  (value not drawn)
FTG5  Use only in PCB  [FIDUCIAL_TOP_S100-200]  (value not drawn)
FTG6  Use only in PCB  [FIDUCIAL_TOP_S100-200]  (value not drawn)
IC38  LM75AIMM/NOPB  [SOP65P490X109-8N]
IC39  LM75AIMM/NOPB  [SOP65P490X109-8N]
IC40  24AA64T-I/MC  [SON50P300X200X100-9N-S175X155]
R105  10k  [RESC1005X40N]
R111  10k  [RESC1005X40N]
R112  10k  [RESC1005X40N]
R113  0  [RESC1005X40N]
R114  0  [RESC1005X40N]
R115  10k  [RESC1005X40N]
R116  10k  [RESC1005X40N]

### Ports
GA0 (in), GA1 (in), SCL (in), SDA (bidir), TEMP_ALARM (bidir)

### Nets
3P3VAUX: C148.1 C149.1 C150.1 IC38.7(A0) IC38.8(+VS) IC39.8(+VS) IC40.8(VCC) R105.2 R111.2 R112.2 R115.2 R116.2
GND: C148.2 C149.2 C150.2 IC38.4(GND) IC38.5(A2) IC38.6(A1) IC39.4(GND) IC39.5(A2) IC39.6(A1) IC39.7(A0) IC40.3(A2) IC40.4(VSS) IC40.7(WP) IC40.9(EP)
SCL: B15.1 IC40.6(SCL) R114.2 R116.1 ; port SCL
SDA: B14.1 IC40.5(SDA) R113.2 R115.1 ; port SDA
TEMP_ALARM: IC38.3(O.S.) IC39.3(O.S.) R105.1 ; port TEMP_ALARM
NetIC38_1: IC38.1(SDA) IC39.1(SDA) R111.1 R113.1
NetIC38_2: IC38.2(SCL) IC39.2(SCL) R112.1 R114.1
NetIC40_1: IC40.1(A0) ; port GA1
NetIC40_2: IC40.2(A1) ; port GA0

### Notes on the sheet
- Copyright CERN 2011.
  This documentation describes Open Hardware and is licensed under the CERN OHL v.1.1. You may redistribute and modify this documentation under the terms of the CERN OHL v.1.1. (http://ohwr.org/CERNOHL). This documentation is distributed WITHOUT ANY EXPRESS OR IMPLIED WARRANTY, INCLUDING OF MERCHANTABILITY, SATISFACTORY QUALITY AND FITNESS FOR A PARTICULAR PURPOSE. Please see the CERN OHL v.1.1 for applicable conditions.
- 24AA64T  = b"10100 GA0 GA1"
- Warning!
  Following the VITA 57.1 standard:
  GA0 goes to A1
  GA1 goes to A0
- (near FTG6) FTG1 ... FTG6
  Reference points for the component mounting machine.
- Trigger threshold voltage:  1V
  Input voltage range for normal operation:
  min. 1.65V (3.3V with 50ohm termination on both ends of the cable, so divided by 2)
  max. 5V with termination on both ends of the cable
  Input is +/- 7.5V tolerant for continous overload and +/-10V tolerant for short term overload.
- Project/Equipment
- Document
- Designer
- Drawn by
- Check.by
- Copyright WUT ISE 2018.
  This documentation describes Open Hardware and is licensed under the CERN OHL v.1.1. You may redistribute and modify this documentation under the terms of the CERN OHL v.1.1. (http://ohwr.org/CERNOHL). This documentation is distributed WITHOUT ANY EXPRESS OR IMPLIED WARRANTY, INCLUDING OF MERCHANTABILITY, SATISFACTORY QUALITY AND FITNESS FOR A PARTICULAR PURPOSE. Please see the CERN OHL v.1.1 for applicable conditions.
- Contact
- File
- Last Mod.
- Print Date
- Sheet
- Size
- A3
- of
- Rev
- (in symbol LM75AIMM/NOPB) °C
- (in symbol R0402_0R_JUMPER) 1%
- (in symbol R0402_10K_1%_0.0625W_100PPM) 1%

### Library data of the parts
B14 B15 = SMD_PAD_D1MM: Through Hole Pad; Part Description: 1mm Diameter SMD Pad; Mounted: No; Part Number: SMD_PAD_D1MM; Component Kind: Standard (No BOM); Component Type: Standard (No BOM); Pin Count: 1; Family: SMD Pad; Socket: No; SMD: No; Sense: No; Status: None; ComponentHeight: 0mm; HelpURL: Undefined; Author: CERN DEM JLC; CreateDate: 10.10.2017; LatestRevisionDate: 10.10.2017; PackageDescription: 1mm Diameter SMD Pad
C148-C150 = CC0201_100NF_6.3V_10%_X5R: Non-polarised capacitor; Part Description: SMD Multilayer Chip Ceramic Capacitor; Manufacturer: GENERIC; Manufacturer1 Part Number: 02016D104KAT2A; Voltage: 6.3V; TC: X5R; Tolerance: ±10%; Table: Capacitors SMD; Part Number: CC0201_100NF_6.3V_10%_X5R; Component Kind: Standard; Component Type: Standard; Pin Count: 2; Value: 100nF; Status: Not Recommended; Manufacturer Part Number: CC0201_100NF_6.3V_10%_X5R; Case: 0201; Mounted: Yes; Socket: No; SMD: Yes; Manufacturer1 Example: AVX; Manufacturer1 ComponentHeight: 0.33mm; HelpURL: \\cern.ch\dfs\Applications\Altium\Datasheets\CC0201_X5R_AVX.pdf; Author: CERN DEM JLC; CreateDate: 2007-12-03; LatestRevisionDate: 2007-12-03
FTG1-FTG6 = FIDUCIAL_TARGET_S100-200: Fiducial Target; Part Description: Square Fiducial Target, Top Layer, 1.0mm, Top Solder 2.0mm, Keepout =2.0mm; Mounted: No; Table: Pads; Part Number: FIDUCIAL_TARGET_S100-200; Component Kind: Standard (No BOM); Component Type: Standard (No BOM); Pin Count: 1; Family: Fiducial; Socket: No; SMD: Yes; Status: None; ComponentHeight: 0mm; Author: CERN DEM JLC; CreateDate: 9/2/2010; LatestRevisionDate: 4/4/2012; PackageDescription: Square Fiducial Target, Top Layer, 1.0mm, Top Solder 2.0mm, Keepout =2.0mm
IC38 IC39 = LM75AIMM/NOPB: Digital Temperature Sensor and Thermal Watchdog with Two-Wire Interface; Part Description: -25° to +100°C ±2°C Digital Temperature Sensor and Thermal Watchdog with Two-Wire Interface; Manufacturer: TEXAS INSTRUMENTS; Table: Sensors; Part Number: LM75AIMM/NOPB; Component Kind: Standard; Component Type: Standard; Device: LM75AIMM/NOPB; PackageDescription: SOP, 0.65mm pitch; 8 pin,3.00mm W X 3.00mm L X 1.09mm H bodyI, PC Medium Density; Manufacturer Part Number: LM75AIMM/NOPB; Pin Count: 8; Case: SSOP8; Mounted: Yes; Socket: No; SMD: Yes; ComponentHeight: 1.09mm; HelpURL: \\cern.ch\dfs\Applications\Altium\Datasheets\LM75AIMM-NOPB.pdf; Author: CERN DEM JLC; CreateDate: 2012-10-15; LatestRevisionDate: 2012-10-15
IC40 = 24AA64T-I/MC: 1.7-5.5V 64K I2C Serial EEPROM; Part Description: 1.7V-5.5V, 64K  (8K x 8-bit) I2C Serial EEPROM; Manufacturer: MICROCHIP TECHNOLOGY; Table: Logic; Part Number: 24AA64T-I/MC; Component Kind: Standard; Component Type: Standard; Device: 24AA64T-I/MC; PackageDescription: SON (DFN), 0.50mm pitch, 8 pin, 2mm X 3mm X 1.00mm H body (w/thermal tab 1.75 X 1.55mm),  IPC Medium Density; Manufacturer Part Number: 24AA64T-I/MC; Pin Count: 9; Case: DFN8; Mounted: Yes; Socket: No; SMD: Yes; ComponentHeight: 1.0mm; HelpURL: \\cern.ch\dfs\Applications\Altium\Datasheets\24AA64T-I-MC.pdf; Author: CERN DEM JLC; CreateDate: 18/11/2009; LatestRevisionDate: 24/1/2011
R105 R111 R112 R115 R116 = R0402_10K_1%_0.0625W_100PPM: Resistor - 1%; Part Description: General Purpose Thick Film Chip Resistor; Manufacturer: GENERIC; Manufacturer1 Part Number: 232270671003L; TC: ±100ppm/°C; Table: Resistors SMD; Part Number: R0402_10K_1%_0.0625W_100PPM; Component Kind: Standard; Component Type: Standard; Pin Count: 2; Value: 10k; Status: Not recommended; Power: 0.0625W; Tolerance: ±1%; Manufacturer Part Number: R0402_10K_1%_0.0625W_100PPM; Case: 0402; Mounted: Yes; Socket: No; SMD: Yes; Manufacturer1 Example: YAGEO PHYCOMP; Manufacturer1 ComponentHeight: 0.4mm; HelpURL: \\cern.ch\dfs\Applications\Altium\Datasheets\R0402_Phycomp_RC0402.pdf; Author: CERN DEM JLC; CreateDate: 3/12/2007; LatestRevisionDate: 17/10/2012
R113 R114 = R0402_0R_JUMPER: Resistor - 1%; Part Description: 1A (0.05R Max DC Resistance) Zero Ohm Jumper; Manufacturer: GENERIC; Manufacturer1 Part Number: 232270591001; Table: Resistors SMD; Part Number: R0402_0R_JUMPER; Component Kind: Standard; Component Type: Standard; Pin Count: 2; Value: 0; Status: Not recommended; Manufacturer Part Number: R0402_0R_JUMPER; Case: 0402; Mounted: Yes; Socket: No; SMD: Yes; Manufacturer1 Example: PHYCOMP; Manufacturer1 ComponentHeight: 0.4mm; HelpURL: \\cern.ch\dfs\Applications\Altium\Datasheets\R0402_Phycomp_RC0402.pdf; Author: CERN DEM JLC; CreateDate: 2007-12-03; LatestRevisionDate: 2008-03-13

## Sheet DACs.SchDoc: =ProjectName
size 420 x 297 mm; Author: T.P.; CompanyName: WUT; DrawnBy: T.P.; Organization: WUT ISE; Address1: Warsaw Univeristy of Technology; Address2: Nowowiejska 15/19; DocumentNumber: 17; Revision: 0.9; SheetNumber: 17; SheetTotal: 36; EDA_Number: ARTIQ; Projet: ARTIQ/SINARA; ModifiedBy: -; CreateDate: XX/XX/XXXX; CheckedDate: -; Title2: DACs.SchDoc; DivGrp: ISE; Designer: G.K. and T.P.; ModifiedDate: -; ProjectName: ADC/DAC MEZZANINE
Used 8 times, as channels U_DACs0, U_DACs1, U_DACs2, U_DACs3, U_DACs4, U_DACs5, U_DACs6, U_DACs7. Parts and nets are listed once, with the designators drawn on the sheet.
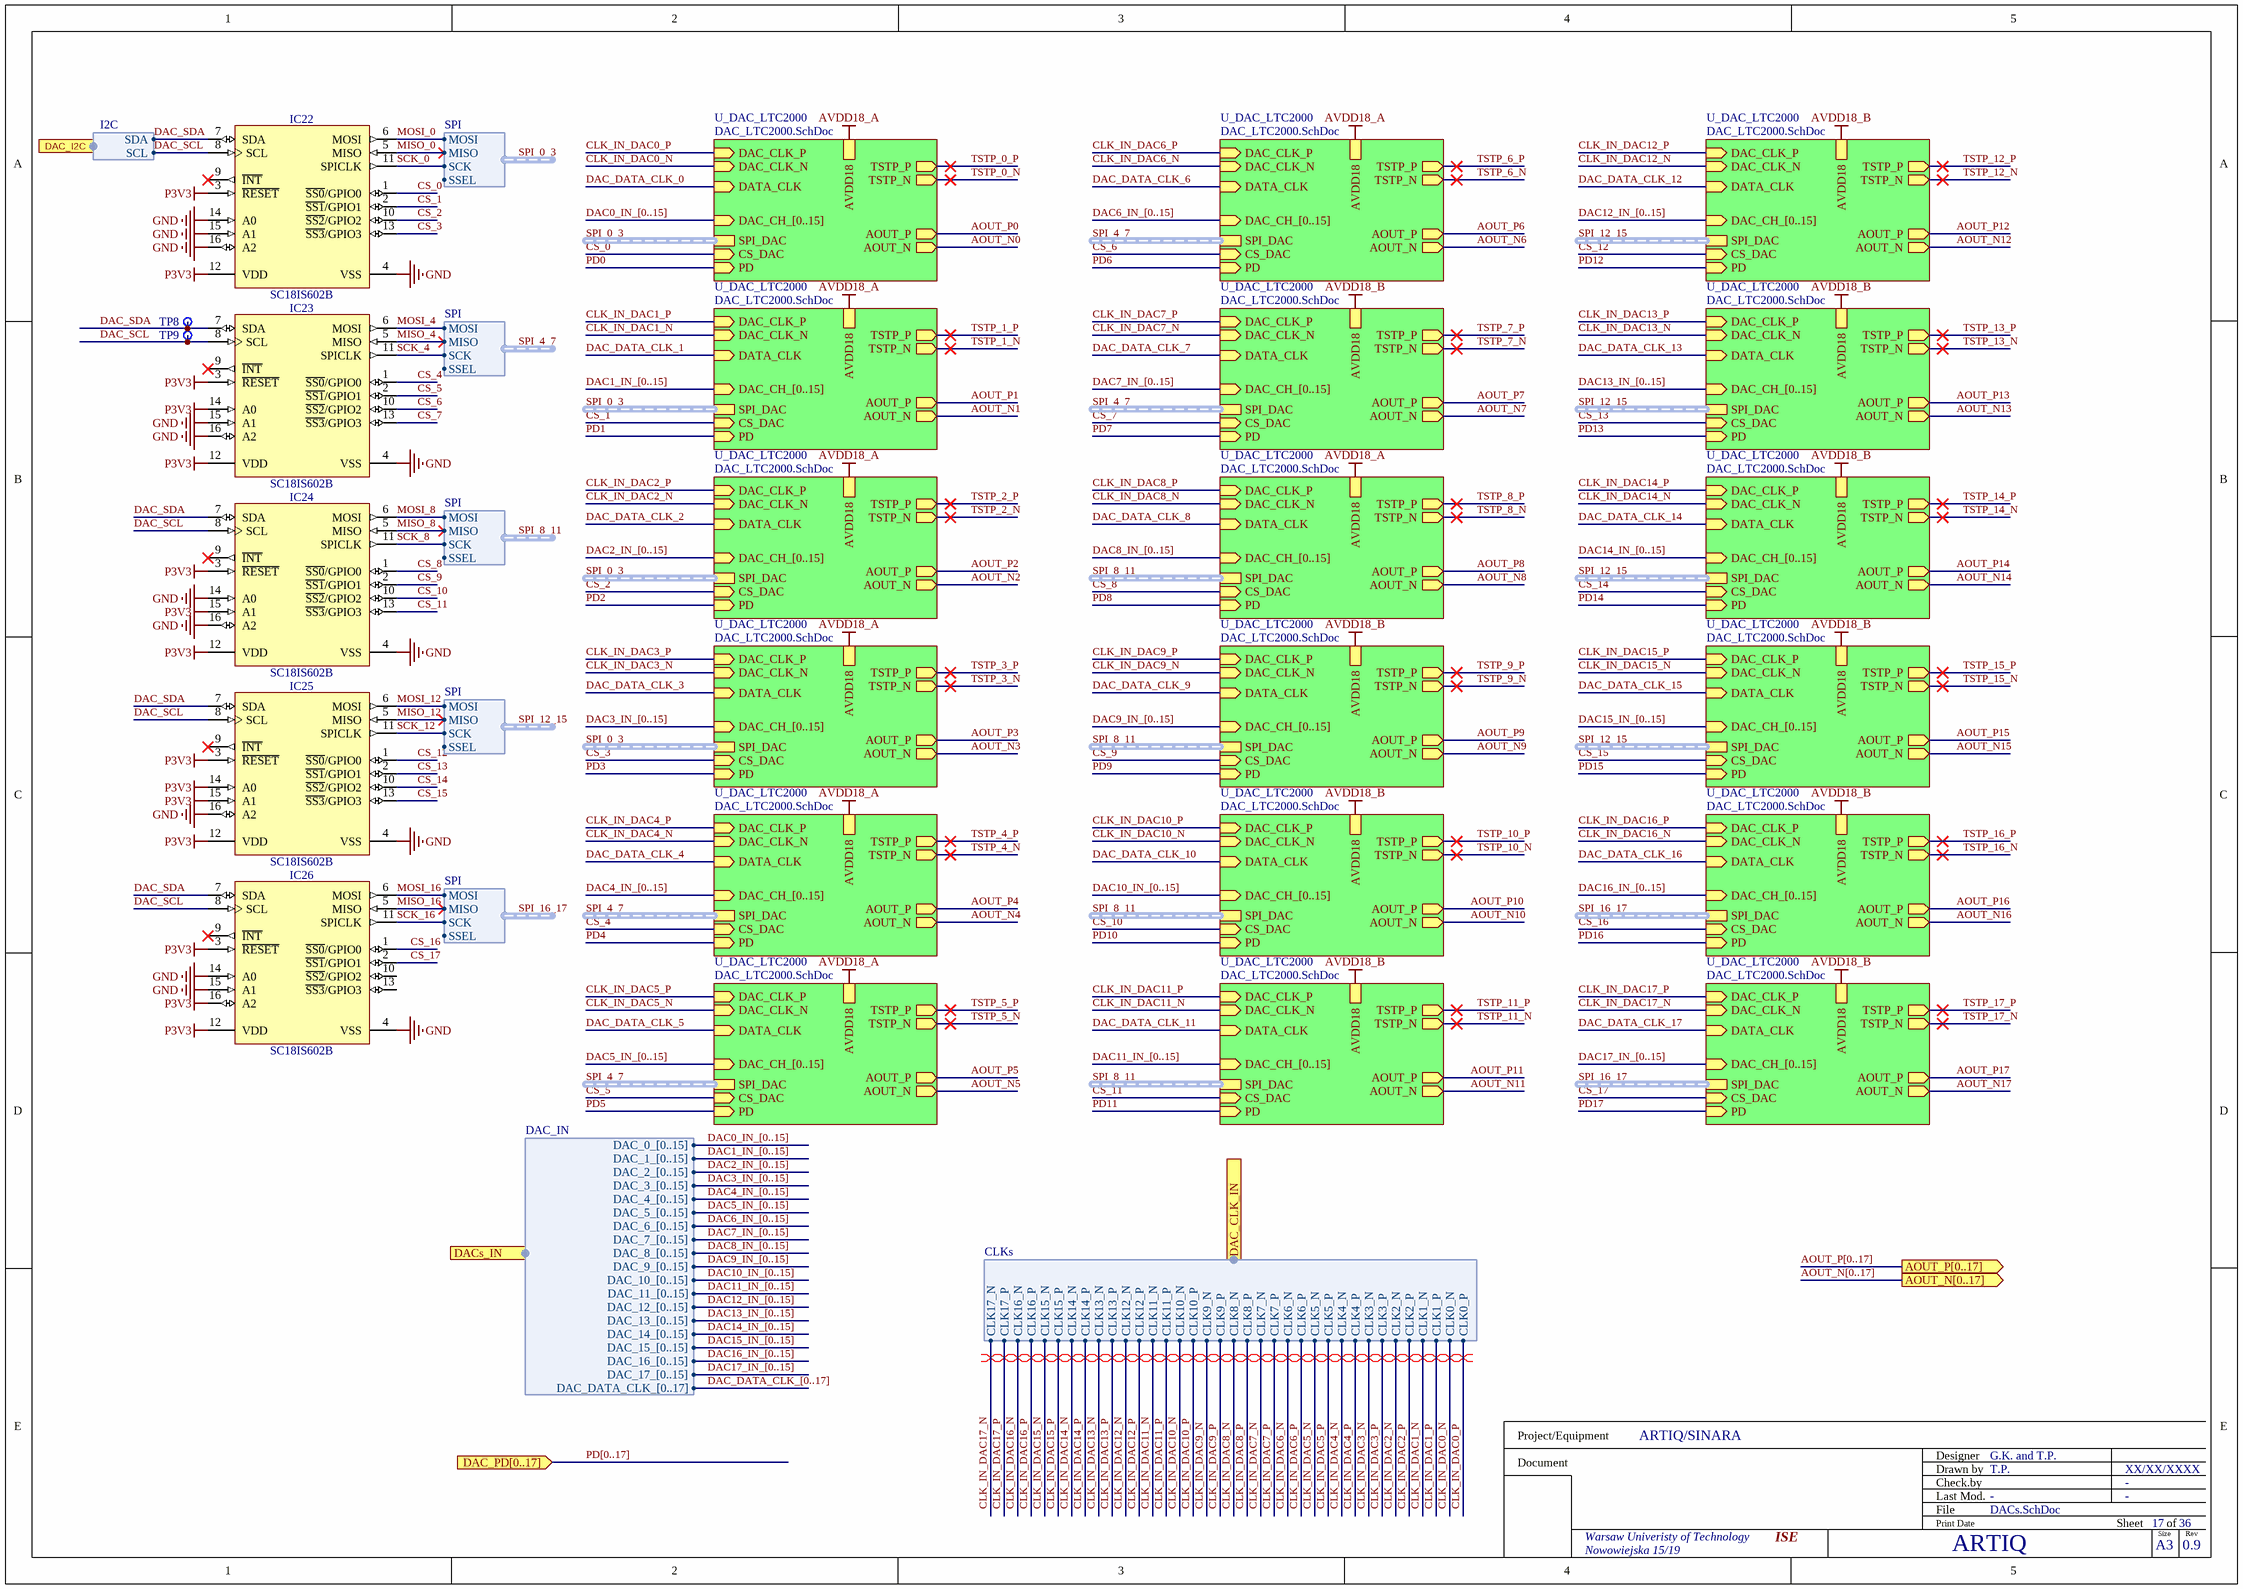
[diagram p2: DACs.SchDoc]

### Parts
IC22  SC18IS602B  [SOP65P640X110-16N]
IC23  SC18IS602B  [SOP65P640X110-16N]
IC24  SC18IS602B  [SOP65P640X110-16N]
IC25  SC18IS602B  [SOP65P640X110-16N]
IC26  SC18IS602B  [SOP65P640X110-16N]
TP8  Test Point  [TPS127]  (value not drawn)
TP9  Test Point  [TPS127]  (value not drawn)

### Sub-sheets
U_DAC_LTC2000 = DAC_LTC2000.SchDoc (file not in this document): DAC_CLK_N (in), CS_DAC (in), DATA_CLK (in), PD (in), SPI_DAC (harness SPI), DAC_CLK_P (in), DAC_CH_[0..15] (in), TSTP_P (out), AOUT_N (out), TSTP_N (out), AOUT_P (out), AVDD18
U_DAC_LTC2000 = DAC_LTC2000.SchDoc (file not in this document): DAC_CLK_N (in), CS_DAC (in), DATA_CLK (in), PD (in), SPI_DAC (harness SPI), DAC_CLK_P (in), DAC_CH_[0..15] (in), TSTP_P (out), AOUT_N (out), TSTP_N (out), AOUT_P (out), AVDD18
U_DAC_LTC2000 = DAC_LTC2000.SchDoc (file not in this document): DAC_CLK_N (in), CS_DAC (in), DATA_CLK (in), PD (in), SPI_DAC (harness SPI), DAC_CLK_P (in), DAC_CH_[0..15] (in), TSTP_P (out), AOUT_N (out), TSTP_N (out), AOUT_P (out), AVDD18
U_DAC_LTC2000 = DAC_LTC2000.SchDoc (file not in this document): DAC_CLK_N (in), CS_DAC (in), DATA_CLK (in), PD (in), SPI_DAC (harness SPI), DAC_CLK_P (in), DAC_CH_[0..15] (in), TSTP_P (out), AOUT_N (out), TSTP_N (out), AOUT_P (out), AVDD18
U_DAC_LTC2000 = DAC_LTC2000.SchDoc (file not in this document): DAC_CLK_N (in), CS_DAC (in), DATA_CLK (in), PD (in), SPI_DAC (harness SPI), DAC_CLK_P (in), DAC_CH_[0..15] (in), TSTP_P (out), AOUT_N (out), TSTP_N (out), AOUT_P (out), AVDD18
U_DAC_LTC2000 = DAC_LTC2000.SchDoc (file not in this document): DAC_CLK_N (in), CS_DAC (in), DATA_CLK (in), PD (in), SPI_DAC (harness SPI), DAC_CLK_P (in), DAC_CH_[0..15] (in), TSTP_P (out), AOUT_N (out), TSTP_N (out), AOUT_P (out), AVDD18
U_DAC_LTC2000 = DAC_LTC2000.SchDoc (file not in this document): DAC_CLK_N (in), CS_DAC (in), DATA_CLK (in), PD (in), SPI_DAC (harness SPI), DAC_CLK_P (in), DAC_CH_[0..15] (in), TSTP_P (out), AOUT_N (out), TSTP_N (out), AOUT_P (out), AVDD18
U_DAC_LTC2000 = DAC_LTC2000.SchDoc (file not in this document): DAC_CLK_N (in), CS_DAC (in), DATA_CLK (in), PD (in), SPI_DAC (harness SPI), DAC_CLK_P (in), DAC_CH_[0..15] (in), TSTP_P (out), AOUT_N (out), TSTP_N (out), AOUT_P (out), AVDD18
U_DAC_LTC2000 = DAC_LTC2000.SchDoc (file not in this document): DAC_CLK_N (in), CS_DAC (in), DATA_CLK (in), PD (in), SPI_DAC (harness SPI), DAC_CLK_P (in), DAC_CH_[0..15] (in), TSTP_P (out), AOUT_N (out), TSTP_N (out), AOUT_P (out), AVDD18
U_DAC_LTC2000 = DAC_LTC2000.SchDoc (file not in this document): DAC_CLK_N (in), CS_DAC (in), DATA_CLK (in), PD (in), SPI_DAC (harness SPI), DAC_CLK_P (in), DAC_CH_[0..15] (in), TSTP_P (out), AOUT_N (out), TSTP_N (out), AOUT_P (out), AVDD18
U_DAC_LTC2000 = DAC_LTC2000.SchDoc (file not in this document): DAC_CLK_N (in), CS_DAC (in), DATA_CLK (in), PD (in), SPI_DAC (harness SPI), DAC_CLK_P (in), DAC_CH_[0..15] (in), TSTP_P (out), AOUT_N (out), TSTP_N (out), AOUT_P (out), AVDD18
U_DAC_LTC2000 = DAC_LTC2000.SchDoc (file not in this document): DAC_CLK_N (in), CS_DAC (in), DATA_CLK (in), PD (in), SPI_DAC (harness SPI), DAC_CLK_P (in), DAC_CH_[0..15] (in), TSTP_P (out), AOUT_N (out), TSTP_N (out), AOUT_P (out), AVDD18
U_DAC_LTC2000 = DAC_LTC2000.SchDoc (file not in this document): DAC_CLK_N (in), CS_DAC (in), DATA_CLK (in), PD (in), SPI_DAC (harness SPI), DAC_CLK_P (in), DAC_CH_[0..15] (in), TSTP_P (out), AOUT_N (out), TSTP_N (out), AOUT_P (out), AVDD18
U_DAC_LTC2000 = DAC_LTC2000.SchDoc (file not in this document): DAC_CLK_N (in), CS_DAC (in), DATA_CLK (in), PD (in), SPI_DAC (harness SPI), DAC_CLK_P (in), DAC_CH_[0..15] (in), TSTP_P (out), AOUT_N (out), TSTP_N (out), AOUT_P (out), AVDD18
U_DAC_LTC2000 = DAC_LTC2000.SchDoc (file not in this document): DAC_CLK_N (in), CS_DAC (in), DATA_CLK (in), PD (in), SPI_DAC (harness SPI), DAC_CLK_P (in), DAC_CH_[0..15] (in), TSTP_P (out), AOUT_N (out), TSTP_N (out), AOUT_P (out), AVDD18
U_DAC_LTC2000 = DAC_LTC2000.SchDoc (file not in this document): DAC_CLK_N (in), CS_DAC (in), DATA_CLK (in), PD (in), SPI_DAC (harness SPI), DAC_CLK_P (in), DAC_CH_[0..15] (in), TSTP_P (out), AOUT_N (out), TSTP_N (out), AOUT_P (out), AVDD18
U_DAC_LTC2000 = DAC_LTC2000.SchDoc (file not in this document): DAC_CLK_N (in), CS_DAC (in), DATA_CLK (in), PD (in), SPI_DAC (harness SPI), DAC_CLK_P (in), DAC_CH_[0..15] (in), TSTP_P (out), AOUT_N (out), TSTP_N (out), AOUT_P (out), AVDD18
U_DAC_LTC2000 = DAC_LTC2000.SchDoc (file not in this document): DAC_CLK_N (in), CS_DAC (in), DATA_CLK (in), PD (in), SPI_DAC (harness SPI), DAC_CLK_P (in), DAC_CH_[0..15] (in), TSTP_P (out), AOUT_N (out), TSTP_N (out), AOUT_P (out), AVDD18

### Ports
AOUT_N[0..17] (out), AOUT_P[0..17] (out), DAC_CLK_IN (harness CLKs), DAC_I2C (harness I2C), DAC_PD[0..17] (in), DACs_IN (harness DAC_IN)

### Harnesses
SPI: SCK, SSEL, MISO, MOSI
I2C: SCL, SDA
CLKs: CLK0_P, CLK0_N, CLK1_P, CLK1_N, CLK2_P, CLK2_N, CLK3_P, CLK3_N, CLK4_P, CLK4_N, CLK5_P, CLK5_N, CLK6_P, CLK6_N, CLK7_P, CLK7_N, CLK8_P, CLK8_N, CLK9_P, CLK9_N, CLK10_P, CLK10_N, CLK11_P, CLK11_N, CLK12_P, CLK12_N, CLK13_P, CLK13_N, CLK14_P, CLK14_N, CLK15_P, CLK15_N, CLK16_P, CLK16_N, CLK17_P, CLK17_N
DAC_IN: DAC_0_[0..15], DAC_1_[0..15], DAC_2_[0..15], DAC_3_[0..15], DAC_4_[0..15], DAC_5_[0..15], DAC_6_[0..15], DAC_7_[0..15], DAC_8_[0..15], DAC_9_[0..15], DAC_10_[0..15], DAC_11_[0..15], DAC_12_[0..15], DAC_13_[0..15], DAC_14_[0..15], DAC_15_[0..15], DAC_16_[0..15], DAC_17_[0..15], DAC_DATA_CLK_[0..17]

### Nets
AVDD18_A: sheet U_DAC_LTC2000/AVDD18, sheet U_DAC_LTC2000/AVDD18, sheet U_DAC_LTC2000/AVDD18, sheet U_DAC_LTC2000/AVDD18, sheet U_DAC_LTC2000/AVDD18, sheet U_DAC_LTC2000/AVDD18, sheet U_DAC_LTC2000/AVDD18, sheet U_DAC_LTC2000/AVDD18
AVDD18_B: sheet U_DAC_LTC2000/AVDD18, sheet U_DAC_LTC2000/AVDD18, sheet U_DAC_LTC2000/AVDD18, sheet U_DAC_LTC2000/AVDD18, sheet U_DAC_LTC2000/AVDD18, sheet U_DAC_LTC2000/AVDD18, sheet U_DAC_LTC2000/AVDD18, sheet U_DAC_LTC2000/AVDD18, sheet U_DAC_LTC2000/AVDD18, sheet U_DAC_LTC2000/AVDD18
GND: IC22.4(VSS) IC22.14(A0) IC22.15(A1) IC22.16(A2) IC23.4(VSS) IC23.15(A1) IC23.16(A2) IC24.4(VSS) IC24.14(A0) IC24.16(A2) IC25.4(VSS) IC25.16(A2) IC26.4(VSS) IC26.14(A0) IC26.15(A1)
P3V3: IC22.3(~{RESET}) IC22.12(VDD) IC23.3(~{RESET}) IC23.12(VDD) IC23.14(A0) IC24.3(~{RESET}) IC24.12(VDD) IC24.15(A1) IC25.3(~{RESET}) IC25.12(VDD) IC25.14(A0) IC25.15(A1) IC26.3(~{RESET}) IC26.12(VDD) IC26.16(A2)
AOUT_N0: sheet U_DAC_LTC2000/AOUT_N
AOUT_N1: sheet U_DAC_LTC2000/AOUT_N
AOUT_N2: sheet U_DAC_LTC2000/AOUT_N
AOUT_N3: sheet U_DAC_LTC2000/AOUT_N
AOUT_N4: sheet U_DAC_LTC2000/AOUT_N
AOUT_N5: sheet U_DAC_LTC2000/AOUT_N
AOUT_N6: sheet U_DAC_LTC2000/AOUT_N
AOUT_N7: sheet U_DAC_LTC2000/AOUT_N
AOUT_N8: sheet U_DAC_LTC2000/AOUT_N
AOUT_N9: sheet U_DAC_LTC2000/AOUT_N
AOUT_N10: sheet U_DAC_LTC2000/AOUT_N
AOUT_N11: sheet U_DAC_LTC2000/AOUT_N
AOUT_N12: sheet U_DAC_LTC2000/AOUT_N
AOUT_N13: sheet U_DAC_LTC2000/AOUT_N
AOUT_N14: sheet U_DAC_LTC2000/AOUT_N
AOUT_N15: sheet U_DAC_LTC2000/AOUT_N
AOUT_N16: sheet U_DAC_LTC2000/AOUT_N
AOUT_N17: sheet U_DAC_LTC2000/AOUT_N
AOUT_P0: sheet U_DAC_LTC2000/AOUT_P
AOUT_P1: sheet U_DAC_LTC2000/AOUT_P
AOUT_P2: sheet U_DAC_LTC2000/AOUT_P
AOUT_P3: sheet U_DAC_LTC2000/AOUT_P
AOUT_P4: sheet U_DAC_LTC2000/AOUT_P
AOUT_P5: sheet U_DAC_LTC2000/AOUT_P
AOUT_P6: sheet U_DAC_LTC2000/AOUT_P
AOUT_P7: sheet U_DAC_LTC2000/AOUT_P
AOUT_P8: sheet U_DAC_LTC2000/AOUT_P
AOUT_P9: sheet U_DAC_LTC2000/AOUT_P
AOUT_P10: sheet U_DAC_LTC2000/AOUT_P
AOUT_P11: sheet U_DAC_LTC2000/AOUT_P
AOUT_P12: sheet U_DAC_LTC2000/AOUT_P
AOUT_P13: sheet U_DAC_LTC2000/AOUT_P
AOUT_P14: sheet U_DAC_LTC2000/AOUT_P
AOUT_P15: sheet U_DAC_LTC2000/AOUT_P
AOUT_P16: sheet U_DAC_LTC2000/AOUT_P
AOUT_P17: sheet U_DAC_LTC2000/AOUT_P
CLK_IN_DAC0_N: sheet U_DAC_LTC2000/DAC_CLK_N, port DAC_CLK_IN.CLK0_N
CLK_IN_DAC0_P: sheet U_DAC_LTC2000/DAC_CLK_P, port DAC_CLK_IN.CLK0_P
CLK_IN_DAC1_N: sheet U_DAC_LTC2000/DAC_CLK_N, port DAC_CLK_IN.CLK1_N
CLK_IN_DAC1_P: sheet U_DAC_LTC2000/DAC_CLK_P, port DAC_CLK_IN.CLK1_P
CLK_IN_DAC2_N: sheet U_DAC_LTC2000/DAC_CLK_N, port DAC_CLK_IN.CLK2_N
CLK_IN_DAC2_P: sheet U_DAC_LTC2000/DAC_CLK_P, port DAC_CLK_IN.CLK2_P
CLK_IN_DAC3_N: sheet U_DAC_LTC2000/DAC_CLK_N, port DAC_CLK_IN.CLK3_N
CLK_IN_DAC3_P: sheet U_DAC_LTC2000/DAC_CLK_P, port DAC_CLK_IN.CLK3_P
CLK_IN_DAC4_N: sheet U_DAC_LTC2000/DAC_CLK_N, port DAC_CLK_IN.CLK4_N
CLK_IN_DAC4_P: sheet U_DAC_LTC2000/DAC_CLK_P, port DAC_CLK_IN.CLK4_P
CLK_IN_DAC5_N: sheet U_DAC_LTC2000/DAC_CLK_N, port DAC_CLK_IN.CLK5_N
CLK_IN_DAC5_P: sheet U_DAC_LTC2000/DAC_CLK_P, port DAC_CLK_IN.CLK5_P
CLK_IN_DAC6_N: sheet U_DAC_LTC2000/DAC_CLK_N, port DAC_CLK_IN.CLK6_N
CLK_IN_DAC6_P: sheet U_DAC_LTC2000/DAC_CLK_P, port DAC_CLK_IN.CLK6_P
CLK_IN_DAC7_N: sheet U_DAC_LTC2000/DAC_CLK_N, port DAC_CLK_IN.CLK7_N
CLK_IN_DAC7_P: sheet U_DAC_LTC2000/DAC_CLK_P, port DAC_CLK_IN.CLK7_P
CLK_IN_DAC8_N: sheet U_DAC_LTC2000/DAC_CLK_N, port DAC_CLK_IN.CLK8_N
CLK_IN_DAC8_P: sheet U_DAC_LTC2000/DAC_CLK_P, port DAC_CLK_IN.CLK8_P
CLK_IN_DAC9_N: sheet U_DAC_LTC2000/DAC_CLK_N, port DAC_CLK_IN.CLK9_N
CLK_IN_DAC9_P: sheet U_DAC_LTC2000/DAC_CLK_P, port DAC_CLK_IN.CLK9_P
CLK_IN_DAC10_N: sheet U_DAC_LTC2000/DAC_CLK_N, port DAC_CLK_IN.CLK10_N
CLK_IN_DAC10_P: sheet U_DAC_LTC2000/DAC_CLK_P, port DAC_CLK_IN.CLK10_P
CLK_IN_DAC11_N: sheet U_DAC_LTC2000/DAC_CLK_N, port DAC_CLK_IN.CLK11_N
CLK_IN_DAC11_P: sheet U_DAC_LTC2000/DAC_CLK_P, port DAC_CLK_IN.CLK11_P
CLK_IN_DAC12_N: sheet U_DAC_LTC2000/DAC_CLK_N, port DAC_CLK_IN.CLK12_N
CLK_IN_DAC12_P: sheet U_DAC_LTC2000/DAC_CLK_P, port DAC_CLK_IN.CLK12_P
CLK_IN_DAC13_N: sheet U_DAC_LTC2000/DAC_CLK_N, port DAC_CLK_IN.CLK13_N
CLK_IN_DAC13_P: sheet U_DAC_LTC2000/DAC_CLK_P, port DAC_CLK_IN.CLK13_P
CLK_IN_DAC14_N: sheet U_DAC_LTC2000/DAC_CLK_N, port DAC_CLK_IN.CLK14_N
CLK_IN_DAC14_P: sheet U_DAC_LTC2000/DAC_CLK_P, port DAC_CLK_IN.CLK14_P
CLK_IN_DAC15_N: sheet U_DAC_LTC2000/DAC_CLK_N, port DAC_CLK_IN.CLK15_N
CLK_IN_DAC15_P: sheet U_DAC_LTC2000/DAC_CLK_P, port DAC_CLK_IN.CLK15_P
CLK_IN_DAC16_N: sheet U_DAC_LTC2000/DAC_CLK_N, port DAC_CLK_IN.CLK16_N
CLK_IN_DAC16_P: sheet U_DAC_LTC2000/DAC_CLK_P, port DAC_CLK_IN.CLK16_P
CLK_IN_DAC17_N: sheet U_DAC_LTC2000/DAC_CLK_N, port DAC_CLK_IN.CLK17_N
CLK_IN_DAC17_P: sheet U_DAC_LTC2000/DAC_CLK_P, port DAC_CLK_IN.CLK17_P
CS_0: IC22.1(~{SS0}/GPIO0) ; sheet U_DAC_LTC2000/CS_DAC
CS_1: IC22.2(~{SS1}/GPIO1) ; sheet U_DAC_LTC2000/CS_DAC
CS_2: IC22.10(~{SS2}/GPIO2) ; sheet U_DAC_LTC2000/CS_DAC
CS_3: IC22.13(~{SS3}/GPIO3) ; sheet U_DAC_LTC2000/CS_DAC
CS_4: IC23.1(~{SS0}/GPIO0) ; sheet U_DAC_LTC2000/CS_DAC
CS_5: IC23.2(~{SS1}/GPIO1) ; sheet U_DAC_LTC2000/CS_DAC
CS_6: IC23.10(~{SS2}/GPIO2) ; sheet U_DAC_LTC2000/CS_DAC
CS_7: IC23.13(~{SS3}/GPIO3) ; sheet U_DAC_LTC2000/CS_DAC
CS_8: IC24.1(~{SS0}/GPIO0) ; sheet U_DAC_LTC2000/CS_DAC
CS_9: IC24.2(~{SS1}/GPIO1) ; sheet U_DAC_LTC2000/CS_DAC
CS_10: IC24.10(~{SS2}/GPIO2) ; sheet U_DAC_LTC2000/CS_DAC
CS_11: IC24.13(~{SS3}/GPIO3) ; sheet U_DAC_LTC2000/CS_DAC
CS_12: IC25.1(~{SS0}/GPIO0) ; sheet U_DAC_LTC2000/CS_DAC
CS_13: IC25.2(~{SS1}/GPIO1) ; sheet U_DAC_LTC2000/CS_DAC
CS_14: IC25.10(~{SS2}/GPIO2) ; sheet U_DAC_LTC2000/CS_DAC
CS_15: IC25.13(~{SS3}/GPIO3) ; sheet U_DAC_LTC2000/CS_DAC
CS_16: IC26.1(~{SS0}/GPIO0) ; sheet U_DAC_LTC2000/CS_DAC
CS_17: IC26.2(~{SS1}/GPIO1) ; sheet U_DAC_LTC2000/CS_DAC
DAC_DATA_CLK_0: sheet U_DAC_LTC2000/DATA_CLK
DAC_DATA_CLK_1: sheet U_DAC_LTC2000/DATA_CLK
DAC_DATA_CLK_2: sheet U_DAC_LTC2000/DATA_CLK
DAC_DATA_CLK_3: sheet U_DAC_LTC2000/DATA_CLK
DAC_DATA_CLK_4: sheet U_DAC_LTC2000/DATA_CLK
DAC_DATA_CLK_5: sheet U_DAC_LTC2000/DATA_CLK
DAC_DATA_CLK_6: sheet U_DAC_LTC2000/DATA_CLK
DAC_DATA_CLK_7: sheet U_DAC_LTC2000/DATA_CLK
DAC_DATA_CLK_8: sheet U_DAC_LTC2000/DATA_CLK
DAC_DATA_CLK_9: sheet U_DAC_LTC2000/DATA_CLK
DAC_DATA_CLK_10: sheet U_DAC_LTC2000/DATA_CLK
DAC_DATA_CLK_11: sheet U_DAC_LTC2000/DATA_CLK
DAC_DATA_CLK_12: sheet U_DAC_LTC2000/DATA_CLK
DAC_DATA_CLK_13: sheet U_DAC_LTC2000/DATA_CLK
DAC_DATA_CLK_14: sheet U_DAC_LTC2000/DATA_CLK
DAC_DATA_CLK_15: sheet U_DAC_LTC2000/DATA_CLK
DAC_DATA_CLK_16: sheet U_DAC_LTC2000/DATA_CLK
DAC_DATA_CLK_17: sheet U_DAC_LTC2000/DATA_CLK
DAC_SCL: IC22.8(SCL) IC23.8(SCL) IC24.8(SCL) IC25.8(SCL) IC26.8(SCL) TP9.1 ; port DAC_I2C.SCL
DAC_SDA: IC22.7(SDA) IC23.7(SDA) IC24.7(SDA) IC25.7(SDA) IC26.7(SDA) TP8.1 ; port DAC_I2C.SDA
MISO_0: IC22.5(MISO) ; sheet U_DAC_LTC2000/SPI_DAC.MISO
MISO_4: IC23.5(MISO) ; sheet U_DAC_LTC2000/SPI_DAC.MISO
MISO_8: IC24.5(MISO) ; sheet U_DAC_LTC2000/SPI_DAC.MISO
MISO_12: IC25.5(MISO) ; sheet U_DAC_LTC2000/SPI_DAC.MISO
MISO_16: IC26.5(MISO) ; sheet U_DAC_LTC2000/SPI_DAC.MISO
MOSI_0: IC22.6(MOSI) ; sheet U_DAC_LTC2000/SPI_DAC.MOSI
MOSI_4: IC23.6(MOSI) ; sheet U_DAC_LTC2000/SPI_DAC.MOSI
MOSI_8: IC24.6(MOSI) ; sheet U_DAC_LTC2000/SPI_DAC.MOSI
MOSI_12: IC25.6(MOSI) ; sheet U_DAC_LTC2000/SPI_DAC.MOSI
MOSI_16: IC26.6(MOSI) ; sheet U_DAC_LTC2000/SPI_DAC.MOSI
PD0: sheet U_DAC_LTC2000/PD
PD1: sheet U_DAC_LTC2000/PD
PD2: sheet U_DAC_LTC2000/PD
PD3: sheet U_DAC_LTC2000/PD
PD4: sheet U_DAC_LTC2000/PD
PD5: sheet U_DAC_LTC2000/PD
PD6: sheet U_DAC_LTC2000/PD
PD7: sheet U_DAC_LTC2000/PD
PD8: sheet U_DAC_LTC2000/PD
PD9: sheet U_DAC_LTC2000/PD
PD10: sheet U_DAC_LTC2000/PD
PD11: sheet U_DAC_LTC2000/PD
PD12: sheet U_DAC_LTC2000/PD
PD13: sheet U_DAC_LTC2000/PD
PD14: sheet U_DAC_LTC2000/PD
PD15: sheet U_DAC_LTC2000/PD
PD16: sheet U_DAC_LTC2000/PD
PD17: sheet U_DAC_LTC2000/PD
SCK_0: IC22.11(SPICLK) ; sheet U_DAC_LTC2000/SPI_DAC.SCK
SCK_4: IC23.11(SPICLK) ; sheet U_DAC_LTC2000/SPI_DAC.SCK
SCK_8: IC24.11(SPICLK) ; sheet U_DAC_LTC2000/SPI_DAC.SCK
SCK_12: IC25.11(SPICLK) ; sheet U_DAC_LTC2000/SPI_DAC.SCK
SCK_16: IC26.11(SPICLK) ; sheet U_DAC_LTC2000/SPI_DAC.SCK
TSTP_0_N: sheet U_DAC_LTC2000/TSTP_N
TSTP_0_P: sheet U_DAC_LTC2000/TSTP_P
TSTP_1_N: sheet U_DAC_LTC2000/TSTP_N
TSTP_1_P: sheet U_DAC_LTC2000/TSTP_P
TSTP_2_N: sheet U_DAC_LTC2000/TSTP_N
TSTP_2_P: sheet U_DAC_LTC2000/TSTP_P
TSTP_3_N: sheet U_DAC_LTC2000/TSTP_N
TSTP_3_P: sheet U_DAC_LTC2000/TSTP_P
TSTP_4_N: sheet U_DAC_LTC2000/TSTP_N
TSTP_4_P: sheet U_DAC_LTC2000/TSTP_P
TSTP_5_N: sheet U_DAC_LTC2000/TSTP_N
TSTP_5_P: sheet U_DAC_LTC2000/TSTP_P
TSTP_6_N: sheet U_DAC_LTC2000/TSTP_N
TSTP_6_P: sheet U_DAC_LTC2000/TSTP_P
TSTP_7_N: sheet U_DAC_LTC2000/TSTP_N
TSTP_7_P: sheet U_DAC_LTC2000/TSTP_P
TSTP_8_N: sheet U_DAC_LTC2000/TSTP_N
TSTP_8_P: sheet U_DAC_LTC2000/TSTP_P
TSTP_9_N: sheet U_DAC_LTC2000/TSTP_N
TSTP_9_P: sheet U_DAC_LTC2000/TSTP_P
TSTP_10_N: sheet U_DAC_LTC2000/TSTP_N
TSTP_10_P: sheet U_DAC_LTC2000/TSTP_P
TSTP_11_N: sheet U_DAC_LTC2000/TSTP_N
TSTP_11_P: sheet U_DAC_LTC2000/TSTP_P
TSTP_12_N: sheet U_DAC_LTC2000/TSTP_N
TSTP_12_P: sheet U_DAC_LTC2000/TSTP_P
TSTP_13_N: sheet U_DAC_LTC2000/TSTP_N
TSTP_13_P: sheet U_DAC_LTC2000/TSTP_P
TSTP_14_N: sheet U_DAC_LTC2000/TSTP_N
TSTP_14_P: sheet U_DAC_LTC2000/TSTP_P
TSTP_15_N: sheet U_DAC_LTC2000/TSTP_N
TSTP_15_P: sheet U_DAC_LTC2000/TSTP_P
TSTP_16_N: sheet U_DAC_LTC2000/TSTP_N
TSTP_16_P: sheet U_DAC_LTC2000/TSTP_P
TSTP_17_N: sheet U_DAC_LTC2000/TSTP_N
TSTP_17_P: sheet U_DAC_LTC2000/TSTP_P

Not connected (* = marked no-connect by the designer): IC22 9(~{INT})*; IC23 9(~{INT})*; IC24 9(~{INT})*; IC25 9(~{INT})*; IC26 9(~{INT})* 10(~{SS2}/GPIO2) 13(~{SS3}/GPIO3)

### Channels
U_DACs0: designators end in A
U_DACs1: designators end in B
U_DACs2: designators end in C
U_DACs3: designators end in D
U_DACs4: designators end in E
U_DACs5: designators end in F
U_DACs6: designators end in G
U_DACs7: designators end in H

### Buses and harness runs
bus AOUT_N[0..17] = port AOUT_N[0..17]
bus AOUT_P[0..17] = port AOUT_P[0..17]
bus DAC0_IN_[0..15]
bus DAC0_IN_[0..15] = sheet U_DAC_LTC2000/DAC_CH_[0..15]
bus DAC1_IN_[0..15]
bus DAC1_IN_[0..15] = sheet U_DAC_LTC2000/DAC_CH_[0..15]
bus DAC2_IN_[0..15]
bus DAC2_IN_[0..15] = sheet U_DAC_LTC2000/DAC_CH_[0..15]
bus DAC3_IN_[0..15]
bus DAC3_IN_[0..15] = sheet U_DAC_LTC2000/DAC_CH_[0..15]
bus DAC4_IN_[0..15]
bus DAC4_IN_[0..15] = sheet U_DAC_LTC2000/DAC_CH_[0..15]
bus DAC5_IN_[0..15]
bus DAC5_IN_[0..15] = sheet U_DAC_LTC2000/DAC_CH_[0..15]
bus DAC6_IN_[0..15]
bus DAC6_IN_[0..15] = sheet U_DAC_LTC2000/DAC_CH_[0..15]
bus DAC7_IN_[0..15]
bus DAC7_IN_[0..15] = sheet U_DAC_LTC2000/DAC_CH_[0..15]
bus DAC8_IN_[0..15]
bus DAC8_IN_[0..15] = sheet U_DAC_LTC2000/DAC_CH_[0..15]
bus DAC9_IN_[0..15]
bus DAC9_IN_[0..15] = sheet U_DAC_LTC2000/DAC_CH_[0..15]
bus DAC10_IN_[0..15]
bus DAC10_IN_[0..15] = sheet U_DAC_LTC2000/DAC_CH_[0..15]
bus DAC11_IN_[0..15]
bus DAC11_IN_[0..15] = sheet U_DAC_LTC2000/DAC_CH_[0..15]
bus DAC12_IN_[0..15]
bus DAC12_IN_[0..15] = sheet U_DAC_LTC2000/DAC_CH_[0..15]
bus DAC13_IN_[0..15]
bus DAC13_IN_[0..15] = sheet U_DAC_LTC2000/DAC_CH_[0..15]
bus DAC14_IN_[0..15]
bus DAC14_IN_[0..15] = sheet U_DAC_LTC2000/DAC_CH_[0..15]
bus DAC15_IN_[0..15]
bus DAC15_IN_[0..15] = sheet U_DAC_LTC2000/DAC_CH_[0..15]
bus DAC16_IN_[0..15]
bus DAC16_IN_[0..15] = sheet U_DAC_LTC2000/DAC_CH_[0..15]
bus DAC17_IN_[0..15]
bus DAC17_IN_[0..15] = sheet U_DAC_LTC2000/DAC_CH_[0..15]
bus DAC_DATA_CLK_[0..17]
bus PD[0..17] = port DAC_PD[0..17]
harness SPI_0_3 = sheet U_DAC_LTC2000/SPI_DAC
harness SPI_4_7 = sheet U_DAC_LTC2000/SPI_DAC
harness SPI_8_11 = sheet U_DAC_LTC2000/SPI_DAC
harness SPI_12_15 = sheet U_DAC_LTC2000/SPI_DAC
harness SPI_16_17 = sheet U_DAC_LTC2000/SPI_DAC

### Layout directives
differential pair: CLK_IN_DAC0_N_U_DACs0, CLK_IN_DAC0_P_U_DACs0, CLK_IN_DAC1_N_U_DACs0, CLK_IN_DAC1_P_U_DACs0, CLK_IN_DAC2_N_U_DACs0, CLK_IN_DAC2_P_U_DACs0, CLK_IN_DAC3_N_U_DACs0, CLK_IN_DAC3_P_U_DACs0, CLK_IN_DAC4_N_U_DACs0, CLK_IN_DAC4_P_U_DACs0, CLK_IN_DAC5_N_U_DACs0, CLK_IN_DAC5_P_U_DACs0, CLK_IN_DAC6_N_U_DACs0, CLK_IN_DAC6_P_U_DACs0, CLK_IN_DAC7_N_U_DACs0, CLK_IN_DAC7_P_U_DACs0, CLK_IN_DAC8_N_U_DACs0, CLK_IN_DAC8_P_U_DACs0, CLK_IN_DAC9_N_U_DACs0, CLK_IN_DAC9_P_U_DACs0, CLK_IN_DAC10_N_U_DACs0, CLK_IN_DAC10_P_U_DACs0, CLK_IN_DAC11_N_U_DACs0, CLK_IN_DAC11_P_U_DACs0, CLK_IN_DAC12_N_U_DACs0, CLK_IN_DAC12_P_U_DACs0, CLK_IN_DAC13_N_U_DACs0, CLK_IN_DAC13_P_U_DACs0, CLK_IN_DAC14_N_U_DACs0, CLK_IN_DAC14_P_U_DACs0, CLK_IN_DAC15_N_U_DACs0, CLK_IN_DAC15_P_U_DACs0, CLK_IN_DAC16_N_U_DACs0, CLK_IN_DAC16_P_U_DACs0, CLK_IN_DAC17_N_U_DACs0, CLK_IN_DAC17_P_U_DACs0

### Notes on the sheet
- Project/Equipment
- Document
- Designer
- Drawn by
- Check.by
- File
- Last Mod.
- Print Date
- Sheet
- Size
- A3
- of
- Rev

### Library data of the parts
IC22-IC26 = SC18IS602B: I2C-bus to SPI bridge; Manufacturer: NXP SEMICONDUCTORS; PressFit: No; Bonding: No; Part Number: SC18IS602B; Component Kind: Standard; Component Type: Standard; Device: SC18IS602B; PackageDescription: SOP, 0.65mm pitch; 16 pin, 4.40mm W X 5.00mm L X 1.10mm H body IPC Medium Density; Part Description: I2C-Bus to SPI Bridge; Manufacturer Part Number: SC18IS602B; Pin Count: 16; Case: TSSOP16; Mounted: Yes; Socket: No; SMD: Yes; Sense: No; ComponentHeight: 1.1mm; HelpURL: \\cern.ch\dfs\Applications\Altium\Datasheets\SC18IS602B.pdf; Author: CERN DEM MR; CreateDate: 14.12.2015; LatestRevisionDate: 14.12.2015
TP8 TP9 = SMD_PAD_1.27X1.27MM: as TP4 on sheet FMC_DAC_125M_14B_16CHA; Part Number: SMD_PAD_1.27X1.27MM; Component Kind: Standard (No BOM); Component Type: Standard (No BOM); Pin Count: 1; Family: Test Point; Socket: No; SMD: Yes; Sense: No; Status: None; ComponentHeight: 0mm; HelpURL: Undefined; Author: CERN DEM JLC; CreateDate: 12.01.2008; LatestRevisionDate: 12.01.2008; PackageDescription: 1.27mm x 1.27mm PCB Copper Area (SMD Test Point)